# EAGLE design artik530_SOM (EAGLE 9.0.0)
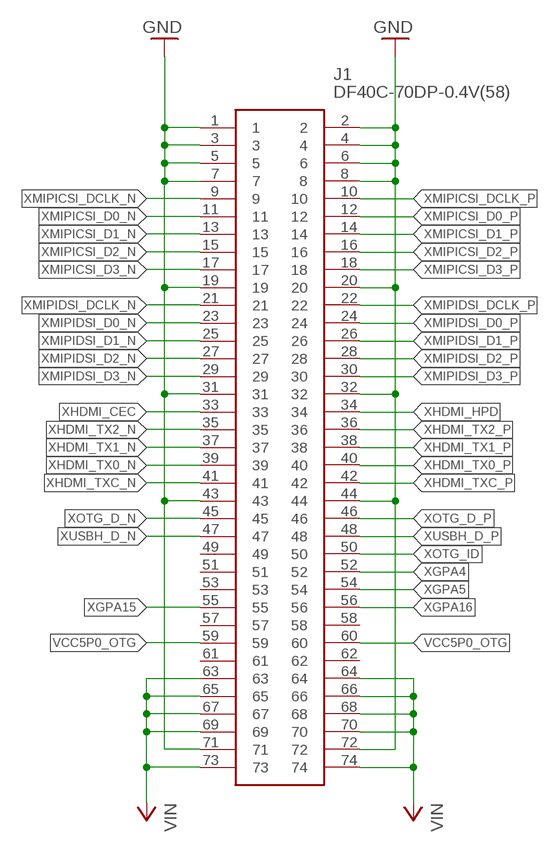
[diagram p0: schematic, sheet 1, part 1 of 2]
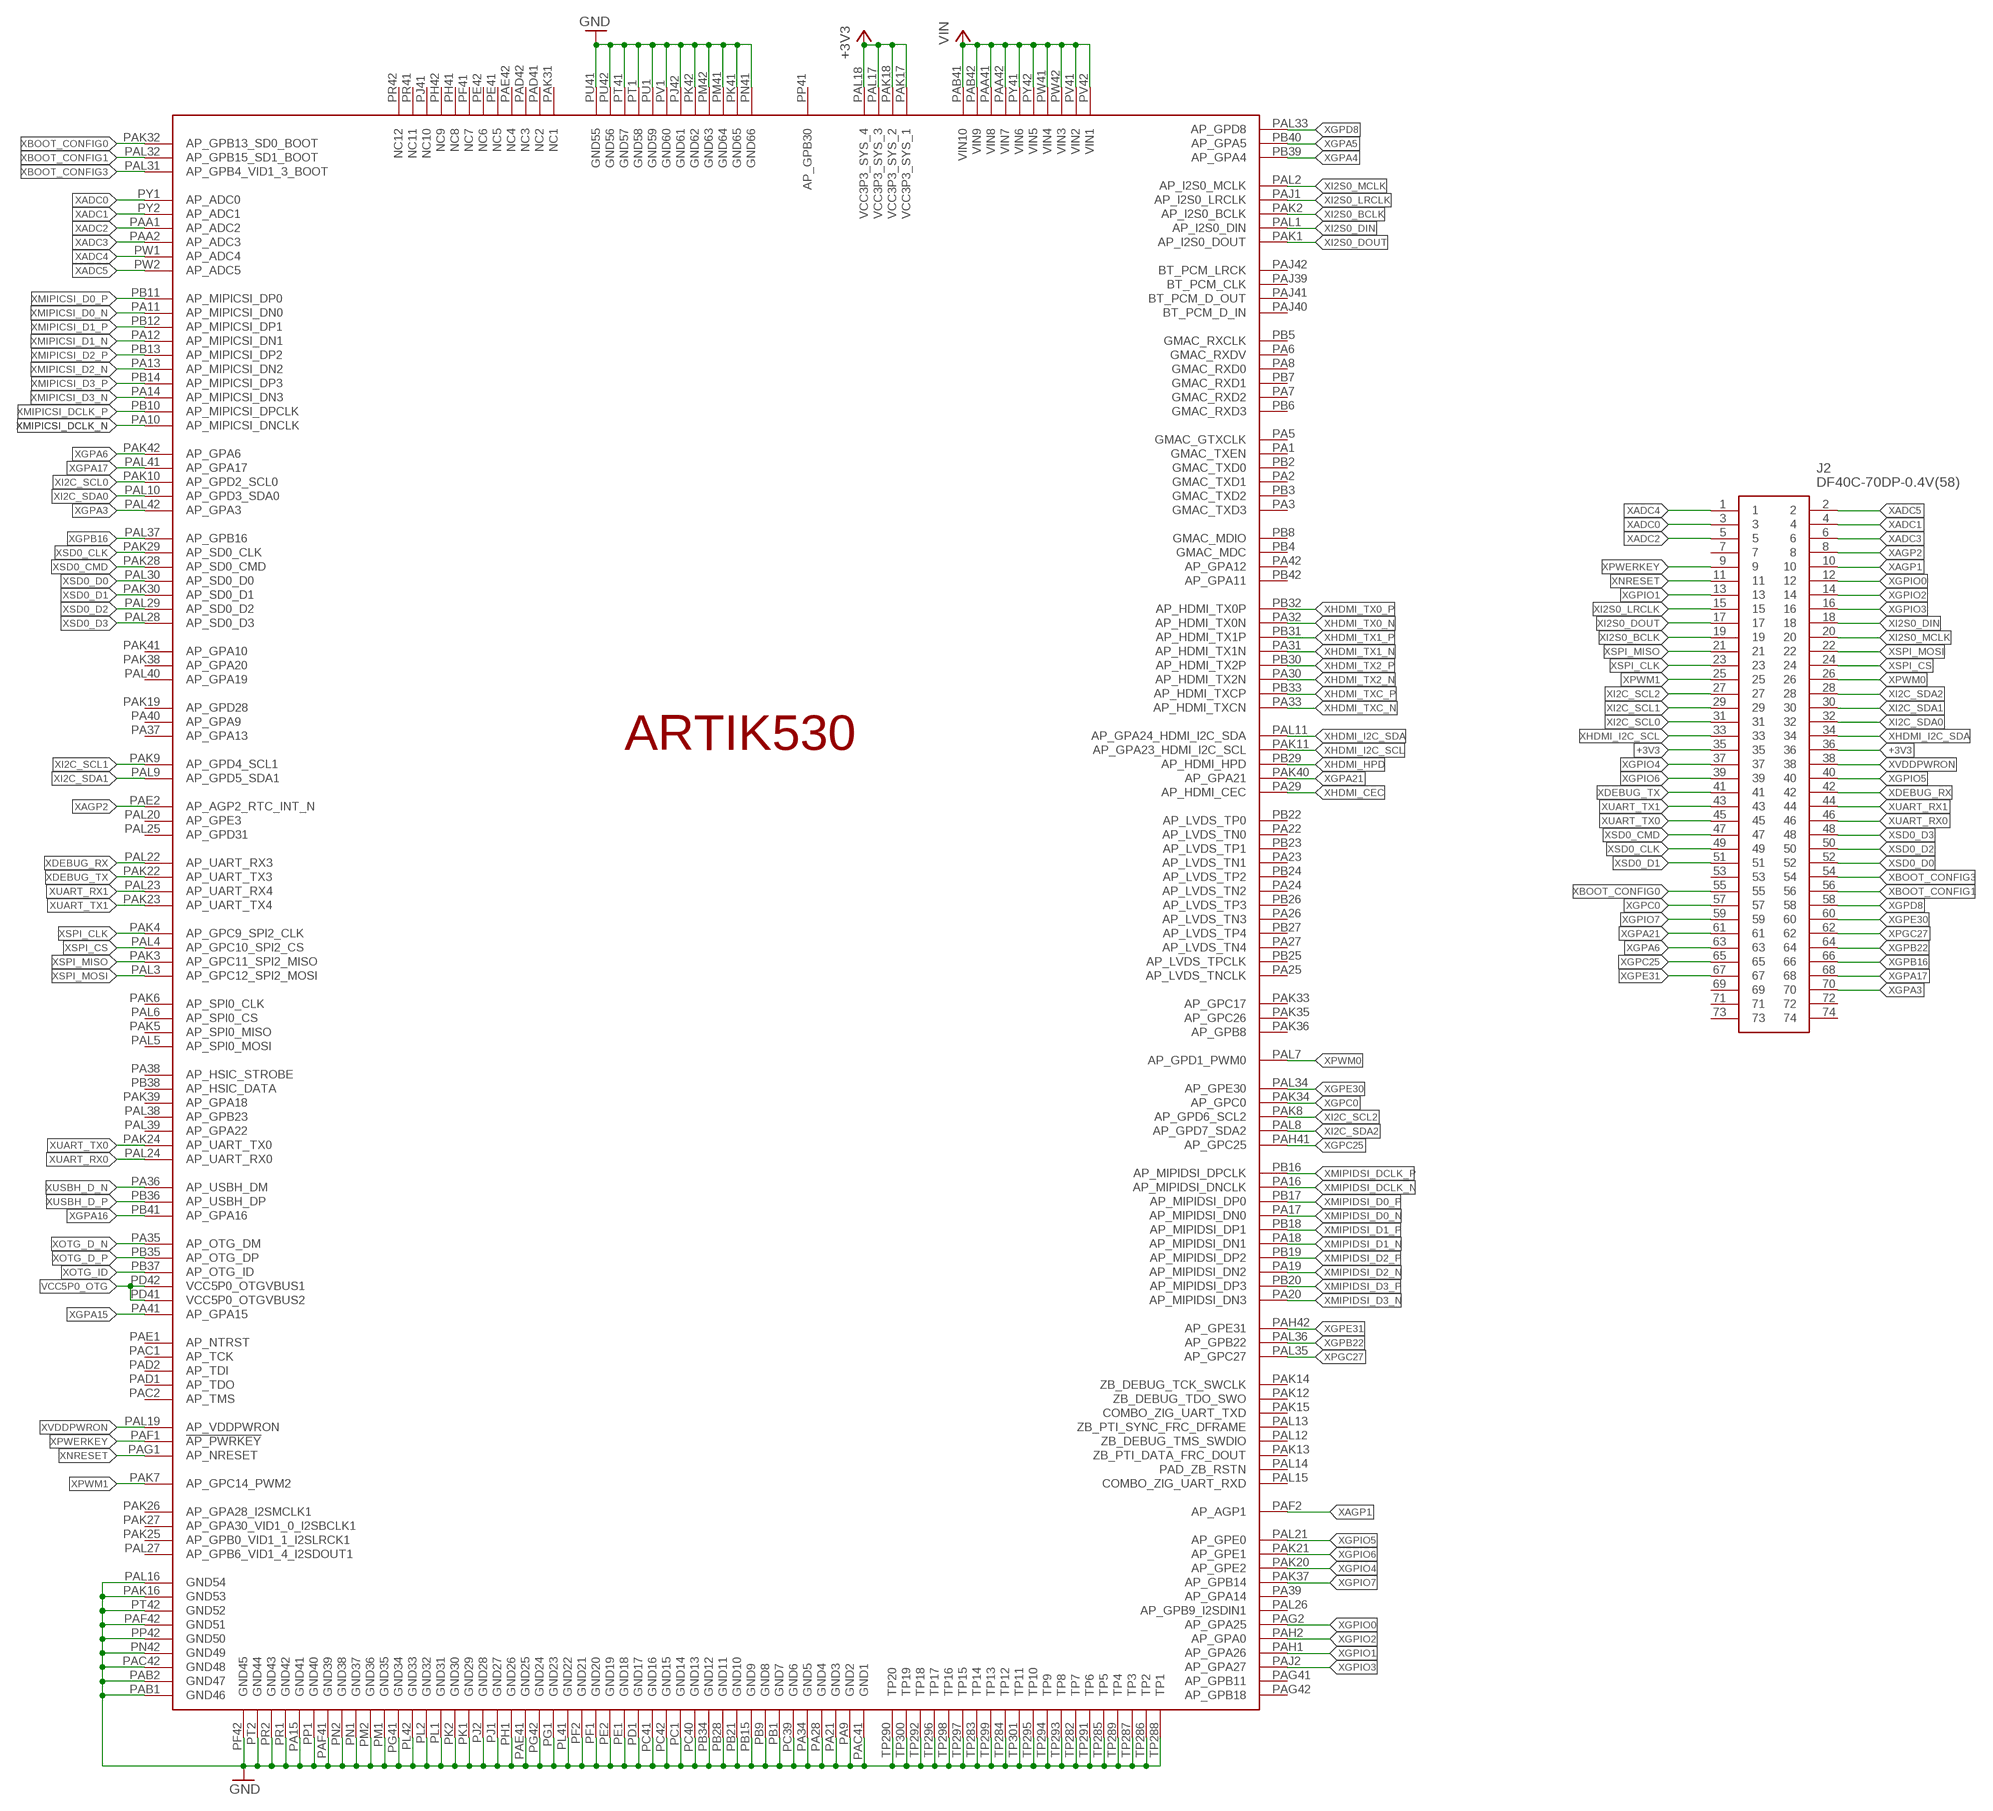
[diagram p1: schematic, sheet 1, part 2 of 2]

## Parts
J1  DF40C-70DP-0.4V(58)  [DF40C70DP04V58]
J2  DF40C-70DP-0.4V(58)  [DF40C70DP04V58]
U$1  ARTIK530ARTIK530_SOM  [ARTIK5]

## Nets
+3V3: J2.35 J2.36 U$1.PAK17(VCC3P3_SYS_1) U$1.PAK18(VCC3P3_SYS_2) U$1.PAL17(VCC3P3_SYS_3) U$1.PAL18(VCC3P3_SYS_4)
GND: J1.1 J1.2 J1.3 J1.4 J1.5 J1.6 J1.7 J1.8 J1.19 J1.20 J1.31 J1.32 J1.43 J1.44 J1.71 J1.72 U$1.PA9(GND2) U$1.PA15(GND41) U$1.PA21(GND3) U$1.PA28(GND4) U$1.PA34(GND5) U$1.PAB1(GND46) U$1.PAB2(GND47) U$1.PAC41(GND1) U$1.PAC42(GND48) U$1.PAE41(GND25) U$1.PAF41(GND39) U$1.PAF42(GND51) U$1.PAK16(GND53) U$1.PAL16(GND54) U$1.PB1(GND7) U$1.PB9(GND8) U$1.PB15(GND9) U$1.PB21(GND10) U$1.PB28(GND11) U$1.PB34(GND12) U$1.PC1(GND14) U$1.PC39(GND6) U$1.PC40(GND13) U$1.PC41(GND16) U$1.PC42(GND15) U$1.PD1(GND17) U$1.PE1(GND18) U$1.PE2(GND19) U$1.PF1(GND20) U$1.PF2(GND21) U$1.PF42(GND45) U$1.PG1(GND23) U$1.PG41(GND34) U$1.PG42(GND24) U$1.PH1(GND26) U$1.PJ1(GND27) U$1.PJ2(GND28) U$1.PJ42(GND61) U$1.PK1(GND29) U$1.PK2(GND30) U$1.PK41(GND65) U$1.PK42(GND62) U$1.PL1(GND31) U$1.PL2(GND32) U$1.PL41(GND22) U$1.PL42(GND33) U$1.PM1(GND35) U$1.PM2(GND36) U$1.PM41(GND64) U$1.PM42(GND63) U$1.PN1(GND37) U$1.PN2(GND38) U$1.PN41(GND66) U$1.PN42(GND49) U$1.PP1(GND40) U$1.PP42(GND50) U$1.PR1(GND42) U$1.PR2(GND43) U$1.PT1(GND58) U$1.PT2(GND44) U$1.PT41(GND57) U$1.PT42(GND52) U$1.PU1(GND59) U$1.PU41(GND55) U$1.PU42(GND56) U$1.PV1(GND60) U$1.TP282(TP7) U$1.TP283(TP14) U$1.TP284(TP12) U$1.TP285(TP5) U$1.TP286(TP2) U$1.TP287(TP3) U$1.TP288(TP1) U$1.TP289(TP4) U$1.TP290(TP20) U$1.TP291(TP6) U$1.TP292(TP18) U$1.TP293(TP8) U$1.TP294(TP9) U$1.TP295(TP10) U$1.TP296(TP17) U$1.TP297(TP15) U$1.TP298(TP16) U$1.TP299(TP13) U$1.TP300(TP19) U$1.TP301(TP11)
VCC: J1.63 J1.64 J1.65 J1.66 J1.67 J1.68 J1.69 J1.70 J1.73 J1.74 U$1.PAA41(VIN8) U$1.PAA42(VIN7) U$1.PAB41(VIN10) U$1.PAB42(VIN9) U$1.PV41(VIN2) U$1.PV42(VIN1) U$1.PW41(VIN4) U$1.PW42(VIN3) U$1.PY41(VIN6) U$1.PY42(VIN5) ; supply symbol labelled VIN
VCC5P0_OTG: J1.59 J1.60 U$1.PD41(VCC5P0_OTGVBUS2) U$1.PD42(VCC5P0_OTGVBUS1)
XADC0: J2.3 U$1.PY1(AP_ADC0)
XADC1: J2.4 U$1.PY2(AP_ADC1)
XADC2: J2.5 U$1.PAA1(AP_ADC2)
XADC3: J2.6 U$1.PAA2(AP_ADC3)
XADC4: J2.1 U$1.PW1(AP_ADC4)
XADC5: J2.2 U$1.PW2(AP_ADC5)
XAGP1: J2.10 U$1.PAF2(AP_AGP1)
XAGP2: J2.8 U$1.PAE2(AP_AGP2_RTC_INT_N)
XBOOT_CONFIG0: J2.55 U$1.PAK32(AP_GPB13_SD0_BOOT)
XBOOT_CONFIG1: J2.56 U$1.PAL32(AP_GPB15_SD1_BOOT)
XBOOT_CONFIG3: J2.54 U$1.PAL31(AP_GPB4_VID1_3_BOOT)
XDEBUG_RX: J2.42 U$1.PAL22(AP_UART_RX3)
XDEBUG_TX: J2.41 U$1.PAK22(AP_UART_TX3)
XGPA3: J2.70 U$1.PAL42(AP_GPA3)
XGPA4: J1.52 U$1.PB39(AP_GPA4)
XGPA5: J1.54 U$1.PB40(AP_GPA5)
XGPA6: J2.63 U$1.PAK42(AP_GPA6)
XGPA15: J1.55 U$1.PA41(AP_GPA15)
XGPA16: J1.56 U$1.PB41(AP_GPA16)
XGPA17: J2.68 U$1.PAL41(AP_GPA17)
XGPA21: J2.61 U$1.PAK40(AP_GPA21)
XGPB16: J2.66 U$1.PAL37(AP_GPB16)
XGPB22: J2.64 U$1.PAL36(AP_GPB22)
XGPC0: J2.57 U$1.PAK34(AP_GPC0)
XGPC25: J2.65 U$1.PAH41(AP_GPC25)
XGPD8: J2.58 U$1.PAL33(AP_GPD8)
XGPE30: J2.60 U$1.PAL34(AP_GPE30)
XGPE31: J2.67 U$1.PAH42(AP_GPE31)
XGPIO0: J2.12 U$1.PAG2(AP_GPA25)
XGPIO1: J2.13 U$1.PAH1(AP_GPA26)
XGPIO2: J2.14 U$1.PAH2(AP_GPA0)
XGPIO3: J2.16 U$1.PAJ2(AP_GPA27)
XGPIO4: J2.37 U$1.PAK20(AP_GPE2)
XGPIO5: J2.40 U$1.PAL21(AP_GPE0)
XGPIO6: J2.39 U$1.PAK21(AP_GPE1)
XGPIO7: J2.59 U$1.PAK37(AP_GPB14)
XHDMI_CEC: J1.33 U$1.PA29(AP_HDMI_CEC)
XHDMI_HPD: J1.34 U$1.PB29(AP_HDMI_HPD)
XHDMI_I2C_SCL: J2.33 U$1.PAK11(AP_GPA23_HDMI_I2C_SCL)
XHDMI_I2C_SDA: J2.34 U$1.PAL11(AP_GPA24_HDMI_I2C_SDA)
XHDMI_TX0_N [differential]: J1.39 U$1.PA32(AP_HDMI_TX0N)
XHDMI_TX0_P [differential]: J1.40 U$1.PB32(AP_HDMI_TX0P)
XHDMI_TX1_N [differential]: J1.37 U$1.PA31(AP_HDMI_TX1N)
XHDMI_TX1_P [differential]: J1.38 U$1.PB31(AP_HDMI_TX1P)
XHDMI_TX2_N [differential]: J1.35 U$1.PA30(AP_HDMI_TX2N)
XHDMI_TX2_P [differential]: J1.36 U$1.PB30(AP_HDMI_TX2P)
XHDMI_TXC_N [differential]: J1.41 U$1.PA33(AP_HDMI_TXCN)
XHDMI_TXC_P [differential]: J1.42 U$1.PB33(AP_HDMI_TXCP)
XI2C_SCL0: J2.31 U$1.PAK10(AP_GPD2_SCL0)
XI2C_SCL1: J2.29 U$1.PAK9(AP_GPD4_SCL1)
XI2C_SCL2: J2.27 U$1.PAK8(AP_GPD6_SCL2)
XI2C_SDA0: J2.32 U$1.PAL10(AP_GPD3_SDA0)
XI2C_SDA1: J2.30 U$1.PAL9(AP_GPD5_SDA1)
XI2C_SDA2: J2.28 U$1.PAL8(AP_GPD7_SDA2)
XI2S0_BCLK: J2.19 U$1.PAK2(AP_I2S0_BCLK)
XI2S0_DIN: J2.18 U$1.PAL1(AP_I2S0_DIN)
XI2S0_DOUT: J2.17 U$1.PAK1(AP_I2S0_DOUT)
XI2S0_LRCLK: J2.15 U$1.PAJ1(AP_I2S0_LRCLK)
XI2S0_MCLK: J2.20 U$1.PAL2(AP_I2S0_MCLK)
XMIPICSI_D0_N [differential]: J1.11 U$1.PA11(AP_MIPICSI_DN0)
XMIPICSI_D0_P [differential]: J1.12 U$1.PB11(AP_MIPICSI_DP0)
XMIPICSI_D1_N [differential]: J1.13 U$1.PA12(AP_MIPICSI_DN1)
XMIPICSI_D1_P [differential]: J1.14 U$1.PB12(AP_MIPICSI_DP1)
XMIPICSI_D2_N [differential]: J1.15 U$1.PA13(AP_MIPICSI_DN2)
XMIPICSI_D2_P [differential]: J1.16 U$1.PB13(AP_MIPICSI_DP2)
XMIPICSI_D3_N [differential]: J1.17 U$1.PA14(AP_MIPICSI_DN3)
XMIPICSI_D3_P [differential]: J1.18 U$1.PB14(AP_MIPICSI_DP3)
XMIPICSI_DCLK_N [differential]: J1.9 U$1.PA10(AP_MIPICSI_DNCLK)
XMIPICSI_DCLK_P [differential]: J1.10 U$1.PB10(AP_MIPICSI_DPCLK)
XMIPIDSI_D0_N [differential]: J1.23 U$1.PA17(AP_MIPIDSI_DN0)
XMIPIDSI_D0_P [differential]: J1.24 U$1.PB17(AP_MIPIDSI_DP0)
XMIPIDSI_D1_N [differential]: J1.25 U$1.PA18(AP_MIPIDSI_DN1)
XMIPIDSI_D1_P [differential]: J1.26 U$1.PB18(AP_MIPIDSI_DP1)
XMIPIDSI_D2_N [differential]: J1.27 U$1.PA19(AP_MIPIDSI_DN2)
XMIPIDSI_D2_P [differential]: J1.28 U$1.PB19(AP_MIPIDSI_DP2)
XMIPIDSI_D3_N [differential]: J1.29 U$1.PA20(AP_MIPIDSI_DN3)
XMIPIDSI_D3_P [differential]: J1.30 U$1.PB20(AP_MIPIDSI_DP3)
XMIPIDSI_DCLK_N [differential]: J1.21 U$1.PA16(AP_MIPIDSI_DNCLK)
XMIPIDSI_DCLK_P [differential]: J1.22 U$1.PB16(AP_MIPIDSI_DPCLK)
XNRESET: J2.11 U$1.PAG1(AP_NRESET)
XOTG_D_N [differential]: J1.45 U$1.PA35(AP_OTG_DM)
XOTG_D_P [differential]: J1.46 U$1.PB35(AP_OTG_DP)
XOTG_ID: J1.50 U$1.PB37(AP_OTG_ID)
XPGC27: J2.62 U$1.PAL35(AP_GPC27)
XPWERKEY: J2.9 U$1.PAF1(!AP_PWRKEY)
XPWM0: J2.26 U$1.PAL7(AP_GPD1_PWM0)
XPWM1: J2.25 U$1.PAK7(AP_GPC14_PWM2)
XSD0_CLK: J2.49 U$1.PAK29(AP_SD0_CLK)
XSD0_CMD: J2.47 U$1.PAK28(AP_SD0_CMD)
XSD0_D0: J2.52 U$1.PAL30(AP_SD0_D0)
XSD0_D1: J2.51 U$1.PAK30(AP_SD0_D1)
XSD0_D2: J2.50 U$1.PAL29(AP_SD0_D2)
XSD0_D3: J2.48 U$1.PAL28(AP_SD0_D3)
XSPI_CLK: J2.23 U$1.PAK4(AP_GPC9_SPI2_CLK)
XSPI_CS: J2.24 U$1.PAL4(AP_GPC10_SPI2_CS)
XSPI_MISO: J2.21 U$1.PAK3(AP_GPC11_SPI2_MISO)
XSPI_MOSI: J2.22 U$1.PAL3(AP_GPC12_SPI2_MOSI)
XUART_RX0: J2.46 U$1.PAL24(AP_UART_RX0)
XUART_RX1: J2.44 U$1.PAL23(AP_UART_RX4)
XUART_TX0: J2.45 U$1.PAK24(AP_UART_TX0)
XUART_TX1: J2.43 U$1.PAK23(AP_UART_TX4)
XUSBH_D_N [differential]: J1.47 U$1.PA36(AP_USBH_DM)
XUSBH_D_P [differential]: J1.48 U$1.PB36(AP_USBH_DP)
XVDDPWRON: J2.38 U$1.PAL19(AP_VDDPWRON)
Unconnected: J1.49 J1.51 J1.53 J1.57 J1.58 J1.61 J1.62 J2.7 J2.53 J2.69 J2.71 J2.72 J2.73 J2.74 U$1.PA1(GMAC_TXEN) U$1.PA2(GMAC_TXD1) U$1.PA3(GMAC_TXD3) U$1.PA5(GMAC_GTXCLK) U$1.PA6(GMAC_RXDV) U$1.PA7(GMAC_RXD2) U$1.PA8(GMAC_RXD0) U$1.PA22(AP_LVDS_TN0) U$1.PA23(AP_LVDS_TN1) U$1.PA24(AP_LVDS_TN2) U$1.PA25(AP_LVDS_TNCLK) U$1.PA26(AP_LVDS_TN3) U$1.PA27(AP_LVDS_TN4) U$1.PA37(AP_GPA13) U$1.PA38(AP_HSIC_STROBE) U$1.PA39(AP_GPA14) U$1.PA40(AP_GPA9) U$1.PA42(AP_GPA12) U$1.PAC1(AP_TCK) U$1.PAC2(AP_TMS) U$1.PAD1(AP_TDO) U$1.PAD2(AP_TDI) U$1.PAD41(NC2) U$1.PAD42(NC3) U$1.PAE1(AP_NTRST) U$1.PAE42(NC4) U$1.PAG41(AP_GPB11) U$1.PAG42(AP_GPB18) U$1.PAJ39(BT_PCM_CLK) U$1.PAJ40(BT_PCM_D_IN) U$1.PAJ41(BT_PCM_D_OUT) U$1.PAJ42(BT_PCM_LRCK) U$1.PAK5(AP_SPI0_MISO) U$1.PAK6(AP_SPI0_CLK) U$1.PAK12(ZB_DEBUG_TDO_SWO) U$1.PAK13(ZB_PTI_DATA_FRC_DOUT) U$1.PAK14(ZB_DEBUG_TCK_SWCLK) U$1.PAK15(COMBO_ZIG_UART_TXD) U$1.PAK19(AP_GPD28) U$1.PAK25(AP_GPB0_VID1_1_I2SLRCK1) U$1.PAK26(AP_GPA28_I2SMCLK1) U$1.PAK27(AP_GPA30_VID1_0_I2SBCLK1) U$1.PAK31(NC1) U$1.PAK33(AP_GPC17) U$1.PAK35(AP_GPC26) U$1.PAK36(AP_GPB8) U$1.PAK38(AP_GPA20) U$1.PAK39(AP_GPA18) U$1.PAK41(AP_GPA10) U$1.PAL5(AP_SPI0_MOSI) U$1.PAL6(AP_SPI0_CS) U$1.PAL12(ZB_DEBUG_TMS_SWDIO) U$1.PAL13(ZB_PTI_SYNC_FRC_DFRAME) U$1.PAL14(PAD_ZB_RSTN) U$1.PAL15(COMBO_ZIG_UART_RXD) U$1.PAL20(AP_GPE3) U$1.PAL25(AP_GPD31) U$1.PAL26(AP_GPB9_I2SDIN1) U$1.PAL27(AP_GPB6_VID1_4_I2SDOUT1) U$1.PAL38(AP_GPB23) U$1.PAL39(AP_GPA22) U$1.PAL40(AP_GPA19) U$1.PB2(GMAC_TXD0) U$1.PB3(GMAC_TXD2) U$1.PB4(GMAC_MDC) U$1.PB5(GMAC_RXCLK) U$1.PB6(GMAC_RXD3) U$1.PB7(GMAC_RXD1) U$1.PB8(GMAC_MDIO) U$1.PB22(AP_LVDS_TP0) U$1.PB23(AP_LVDS_TP1) U$1.PB24(AP_LVDS_TP2) U$1.PB25(AP_LVDS_TPCLK) U$1.PB26(AP_LVDS_TP3) U$1.PB27(AP_LVDS_TP4) U$1.PB38(AP_HSIC_DATA) U$1.PB42(AP_GPA11) U$1.PE41(NC5) U$1.PE42(NC6) U$1.PF41(NC7) U$1.PH41(NC8) U$1.PH42(NC9) U$1.PJ41(NC10) U$1.PP41(AP_GPB30) U$1.PR41(NC11) U$1.PR42(NC12)

## Library data of the parts
J1 J2 = DF40C-70DP-0.4V(51):DF40C-70DP-0.4V(58): Hirose DF40 Series, 0.4mm Pitch 70 Way 2 Row Straight PCB Header, Solder Termination, 0.3A Source: Datasheet <https://www.hirose.com/product/en/download_file/key_name/DF40C-70DP-0.4V(51)/category/Drawing (2D)/doc_file_id/145625/?file_category_id=6&item_id=06844015258&is_series=>; ARROW_PART_NUMBER: DF40C-70DP-0.4V(51); ARROW_PRICE/STOCK: http://uk.rs-online.com/web/p/products/1664877; DESCRIPTION: Hirose DF40 Series, 0.4mm Pitch 70 Way 2 Row Straight PCB Header, Solder Termination, 0.3A; HEIGHT: 1mm; MANUFACTURER_NAME: Hirose; MANUFACTURER_PART_NUMBER: DF40C-70DP-0.4V(51); RS_PART_NUMBER: 1664877; RS_PRICE/STOCK: http://uk.rs-online.com/web/p/products/1664877
U$1 = ARTIK530_EAGLE_LIB:ARTIK530

## Net classes
1 differential: width 0.127 mm, drill 0.3 mm, clearance 0.127 mm

## Board
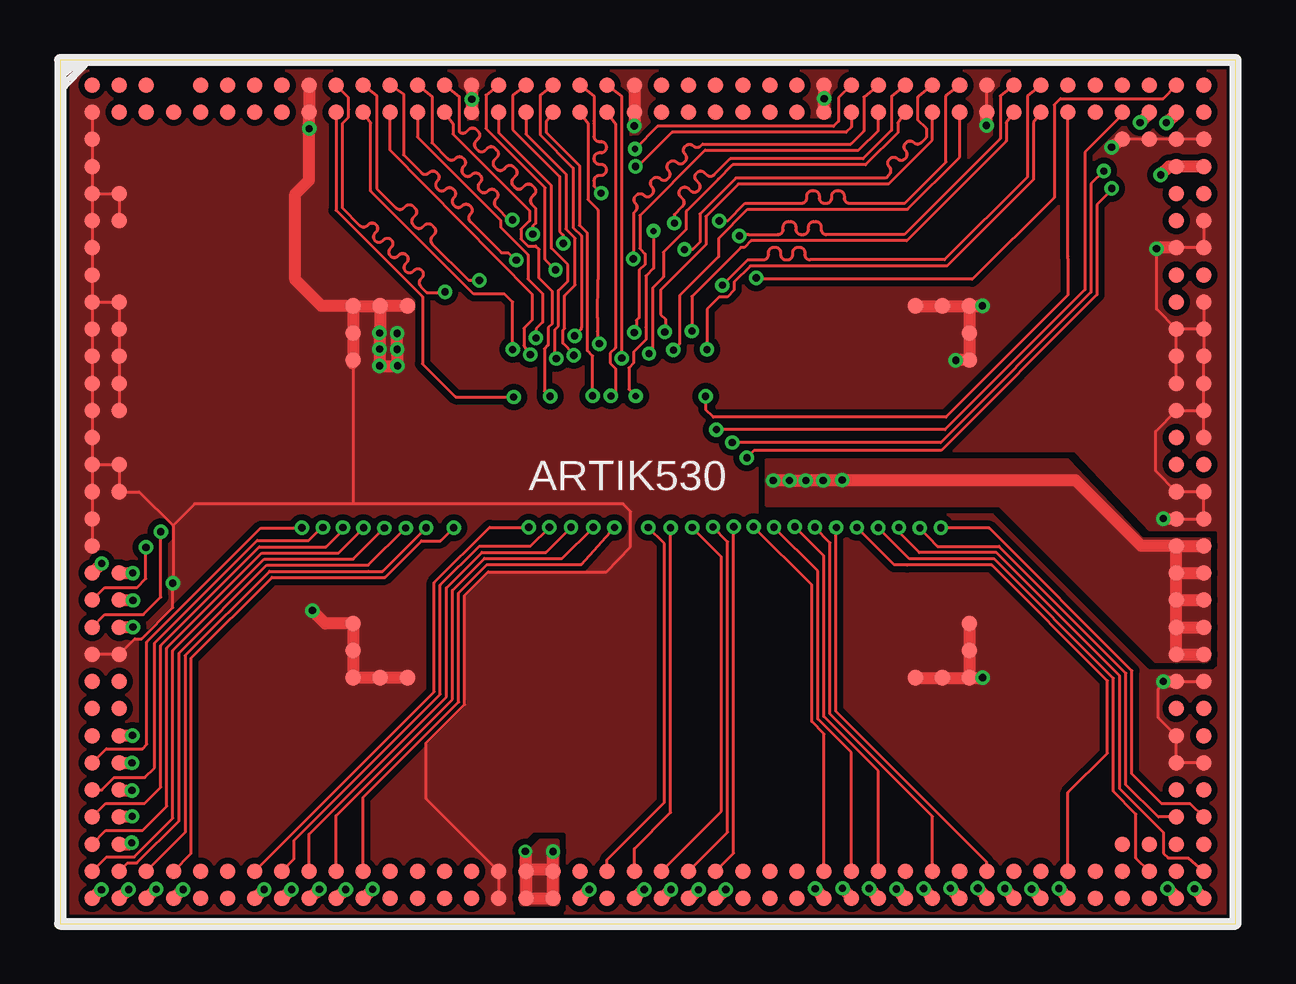
[diagram p2: board, top side]
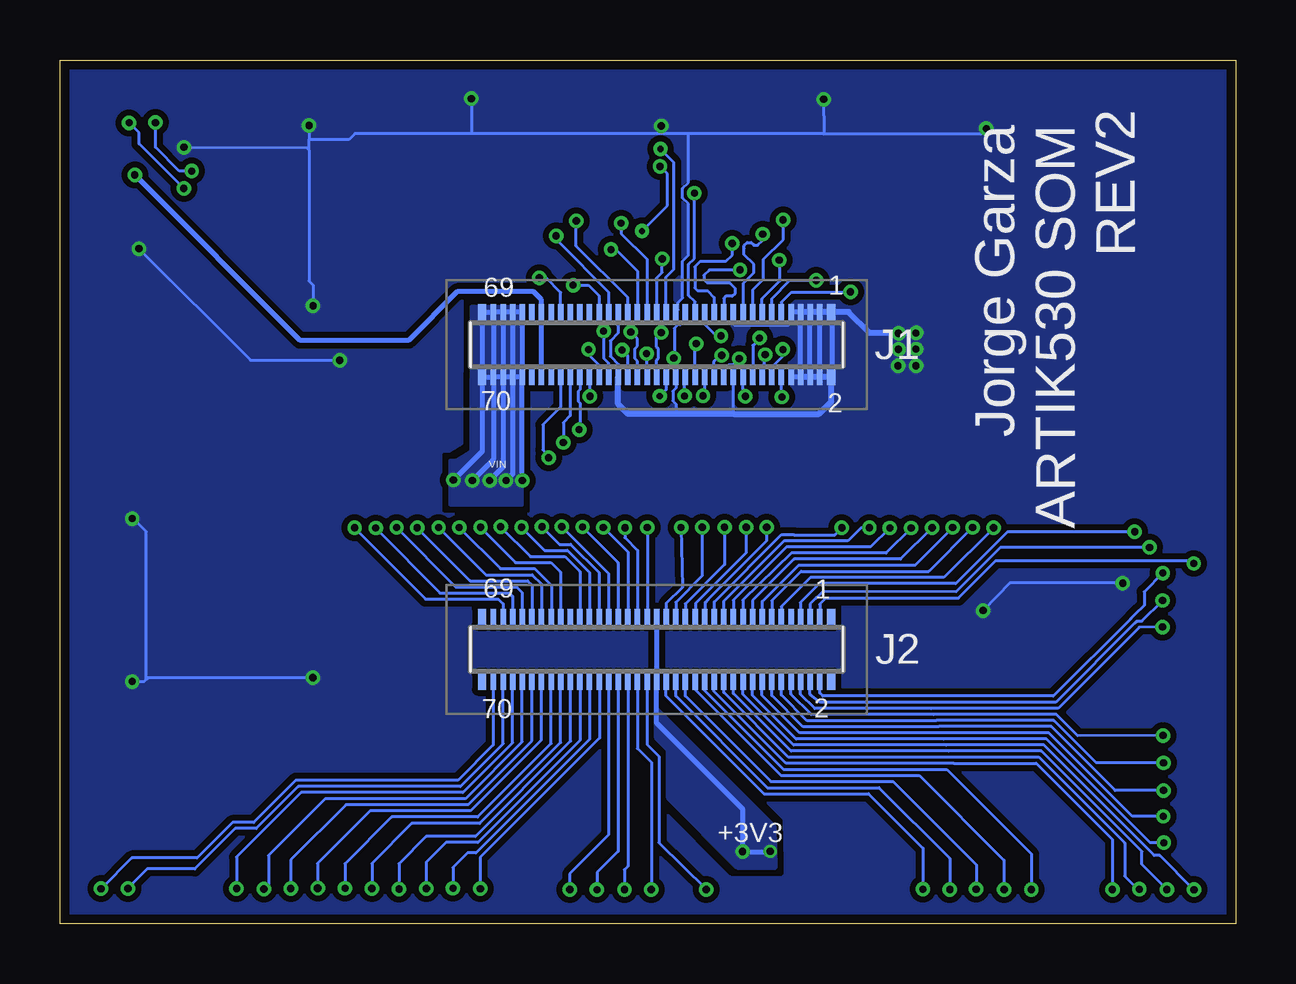
[diagram p3: board, bottom side, seen from below]

Size 49 x 36 mm. Coordinates in mm from the lower left corner, seen from the top.
Outline: 0,0 49,0 49,36 0,36 0,0
Copper layers (1*16): Top 0.035559375mm / dielectric 1.6mm / Bottom 0.035559375mm
Design rules "oshpark-2layer": minimum track width 5mil, minimum drill 10mil, track to track 5mil, track to pad 5mil, pad to pad 5mil, via to via 5mil, smd to smd 5mil, copper to edge 15mil, drill to drill 6mil, minimum pad ring 5mil, minimum via ring 5mil, stop-mask expansion 2.5mil, vias tented up to drill 15mil, thermal gap 10mil

### Footprints (pad centres in the part's own frame; a part is rotated, then mirrored left to right if it is on the bottom)
DF40C70DP04V58 = smd 0.23 x 0.66: 1 -6.8,-1.355; 2 -6.8,1.355; 3 -6.4,-1.355; 4 -6.4,1.355; 5 -6,-1.355; 6 -6,1.355; 7 -5.6,-1.355; 8 -5.6,1.355; 9 -5.2,-1.355; 10 -5.2,1.355; 11 -4.8,-1.355; 12 -4.8,1.355; 13 -4.4,-1.355; 14 -4.4,1.355; 15 -4,-1.355; 16 -4,1.355; 17 -3.6,-1.355; 18 -3.6,1.355; 19 -3.2,-1.355; 20 -3.2,1.355; 21 -2.8,-1.355; 22 -2.8,1.355; 23 -2.4,-1.355; 24 -2.4,1.355; 25 -2,-1.355; 26 -2,1.355; 27 -1.6,-1.355; 28 -1.6,1.355; 29 -1.2,-1.355; 30 -1.2,1.355; 31 -0.8,-1.355; 32 -0.8,1.355; 33 -0.4,-1.355; 34 -0.4,1.355; 35 0,-1.355; 36 0,1.355; 37 0.4,-1.355; 38 0.4,1.355; 39 0.8,-1.355; 40 0.8,1.355; 41 1.2,-1.355; 42 1.2,1.355; 43 1.6,-1.355; 44 1.6,1.355; 45 2,-1.355; 46 2,1.355; 47 2.4,-1.355; 48 2.4,1.355; 49 2.8,-1.355; 50 2.8,1.355; 51 3.2,-1.355; 52 3.2,1.355; 53 3.6,-1.355; 54 3.6,1.355; 55 4,-1.355; 56 4,1.355; 57 4.4,-1.355; 58 4.4,1.355; 59 4.8,-1.355; 60 4.8,1.355; 61 5.2,-1.355; 62 5.2,1.355; 63 5.6,-1.355; 64 5.6,1.355; 65 6,-1.355; 66 6,1.355; 67 6.4,-1.355; 68 6.4,1.355; 69 6.8,-1.355; 70 6.8,1.355 | smd 0.35 x 0.66: 71 -7.275,-1.355; 72 -7.275,1.355; 73 7.275,1.355; 74 7.275,-1.355
ARTIK5 = smd 0.65 x 0.65: PA1 1.34,34.95; PA2 2.47,34.95; PA3 3.6,34.95; PA5 5.86,34.95; PA6 6.99,34.95; PA7 8.12,34.95; PA8 9.25,34.95; PA9 10.38,34.95; PA10 11.51,34.95; PA11 12.64,34.95; PA12 13.77,34.95; PA13 14.9,34.95; PA14 16.03,34.95; PA15 17.16,34.95; PA16 18.29,34.95; PA17 19.42,34.95; PA18 20.55,34.95; PA19 21.68,34.95; PA20 22.81,34.95; PA21 23.94,34.95; PA22 25.07,34.95; PA23 26.2,34.95; PA24 27.33,34.95; PA25 28.46,34.95; PA26 29.59,34.95; PA27 30.72,34.95; PA28 31.85,34.95; PA29 32.98,34.95; PA30 34.11,34.95; PA31 35.24,34.95; PA32 36.37,34.95; PA33 37.5,34.95; PA34 38.63,34.95; PA35 39.76,34.95; PA36 40.89,34.95; PA37 42.02,34.95; PA38 43.15,34.95; PA39 44.28,34.95; PA40 45.41,34.95; PA41 46.54,34.95; PA42 47.67,34.95; PAA1 1.34,12.35; PAA2 2.47,12.35; PAA41 46.54,12.35; PAA42 47.67,12.35; PAB1 1.34,11.22; PAB2 2.47,11.22; PAB41 46.54,11.22; PAB42 47.67,11.22; PAC1 1.34,10.09; PAC2 2.47,10.09; PAC41 46.54,10.09; PAC42 47.67,10.09; PAD1 1.34,8.96; PAD2 2.47,8.96; PAD41 46.54,8.96; PAD42 47.67,8.96; PAE1 1.34,7.83; PAE2 2.47,7.83; PAE41 46.54,7.83; PAE42 47.67,7.83; PAF1 1.34,6.7; PAF2 2.47,6.7; PAF41 46.54,6.7; PAF42 47.67,6.7; PAG1 1.34,5.57; PAG2 2.47,5.57; PAG41 46.54,5.57; PAG42 47.67,5.57; PAH1 1.34,4.44; PAH2 2.47,4.44; PAH41 46.54,4.44; PAH42 47.67,4.44; PAJ1 1.34,3.31; PAJ2 2.47,3.31; PAJ39 44.28,3.31; PAJ40 45.41,3.31; PAJ41 46.54,3.31; PAJ42 47.67,3.31; PAK1 1.34,2.18; PAK2 2.47,2.18; PAK3 3.6,2.18; PAK4 4.73,2.18; PAK5 5.86,2.18; PAK6 6.99,2.18; PAK7 8.12,2.18; PAK8 9.25,2.18; PAK9 10.38,2.18; PAK10 11.51,2.18; PAK11 12.64,2.18; PAK12 13.77,2.18; PAK13 14.9,2.18; PAK14 16.03,2.18; PAK15 17.16,2.18; PAK16 18.29,2.18; PAK17 19.42,2.18; PAK18 20.55,2.18; PAK19 21.68,2.18; PAK20 22.81,2.18; PAK21 23.94,2.18; PAK22 25.07,2.18; PAK23 26.2,2.18; PAK24 27.33,2.18; PAK25 28.46,2.18; PAK26 29.59,2.18; PAK27 30.72,2.18; PAK28 31.85,2.18; PAK29 32.98,2.18; PAK30 34.11,2.18; PAK31 35.24,2.18; PAK32 36.37,2.18; PAK33 37.5,2.18; PAK34 38.63,2.18; PAK35 39.76,2.18; PAK36 40.89,2.18; PAK37 42.02,2.18; PAK38 43.15,2.18; PAK39 44.28,2.18; PAK40 45.41,2.18; PAK41 46.54,2.18; PAK42 47.67,2.18; PAL1 1.34,1.05; PAL2 2.47,1.05; PAL3 3.6,1.05; PAL4 4.73,1.05; PAL5 5.86,1.05; PAL6 6.99,1.05; PAL7 8.12,1.05; PAL8 9.25,1.05; PAL9 10.38,1.05; PAL10 11.51,1.05; PAL11 12.64,1.05; PAL12 13.77,1.05; PAL13 14.9,1.05; PAL14 16.03,1.05; PAL15 17.16,1.05; PAL16 18.29,1.05; PAL17 19.42,1.05; PAL18 20.55,1.05; PAL19 21.68,1.05; PAL20 22.81,1.05; PAL21 23.94,1.05; PAL22 25.07,1.05; PAL23 26.2,1.05; PAL24 27.33,1.05; PAL25 28.46,1.05; PAL26 29.59,1.05; PAL27 30.72,1.05; PAL28 31.85,1.05; PAL29 32.98,1.05; PAL30 34.11,1.05; PAL31 35.24,1.05; PAL32 36.37,1.05; PAL33 37.5,1.05; PAL34 38.63,1.05; PAL35 39.76,1.05; PAL36 40.89,1.05; PAL37 42.02,1.05; PAL38 43.15,1.05; PAL39 44.28,1.05; PAL40 45.41,1.05; PAL41 46.54,1.05; PAL42 47.67,1.05; PB1 1.34,33.82; PB2 2.47,33.82; PB3 3.6,33.82; PB4 4.73,33.82; PB5 5.86,33.82; PB6 6.99,33.82; PB7 8.12,33.82; PB8 9.25,33.82; PB9 10.38,33.82; PB10 11.51,33.82; PB11 12.64,33.82; PB12 13.77,33.82; PB13 14.9,33.82; PB14 16.03,33.82; PB15 17.16,33.82; PB16 18.29,33.82; PB17 19.42,33.82; PB18 20.55,33.82; PB19 21.68,33.82; PB20 22.81,33.82; PB21 23.94,33.82; PB22 25.07,33.82; PB23 26.2,33.82; PB24 27.33,33.82; PB25 28.46,33.82; PB26 29.59,33.82; PB27 30.72,33.82; PB28 31.85,33.82; PB29 32.98,33.82; PB30 34.11,33.82; PB31 35.24,33.82; PB32 36.37,33.82; PB33 37.5,33.82; PB34 38.63,33.82; PB35 39.76,33.82; PB36 40.89,33.82; PB37 42.02,33.82; PB38 43.15,33.82; PB39 44.28,33.82; PB40 45.41,33.82; PB41 46.54,33.82; PB42 47.67,33.82; PC1 1.34,32.69; PC39 44.28,32.69; PC40 45.41,32.69; PC41 46.54,32.69; PC42 47.67,32.69; PD1 1.34,31.56; PD41 46.54,31.56; PD42 47.67,31.56; PE1 1.34,30.43; PE2 2.47,30.43; PE41 46.54,30.43; PE42 47.67,30.43; PF1 1.34,29.3; PF2 2.47,29.3; PF41 46.54,29.3; PF42 47.67,29.3; PG1 1.34,28.17; PG41 46.54,28.17; PG42 47.67,28.17; PH1 1.34,27.04; PH41 46.54,27.04; PH42 47.67,27.04; PJ1 1.34,25.91; PJ2 2.47,25.91; PJ41 46.54,25.91; PJ42 47.67,25.91; PK1 1.34,24.78; PK2 2.47,24.78; PK41 46.54,24.78; PK42 47.67,24.78; PL1 1.34,23.65; PL2 2.47,23.65; PL41 46.54,23.65; PL42 47.67,23.65; PM1 1.34,22.52; PM2 2.47,22.52; PM41 46.54,22.52; PM42 47.67,22.52; PN1 1.34,21.39; PN2 2.47,21.39; PN41 46.54,21.39; PN42 47.67,21.39; PP1 1.34,20.26; PP41 46.54,20.26; PP42 47.67,20.26; PR1 1.34,19.13; PR2 2.47,19.13; PR41 46.54,19.13; PR42 47.67,19.13; PT1 1.34,18; PT2 2.47,18; PT41 46.54,18; PT42 47.67,18; PU1 1.34,16.87; PU41 46.54,16.87; PU42 47.67,16.87; PV1 1.34,15.74; PV41 46.54,15.74; PV42 47.67,15.74; PW1 1.34,14.61; PW2 2.47,14.61; PW41 46.54,14.61; PW42 47.67,14.61; PY1 1.34,13.48; PY2 2.47,13.48; PY41 46.54,13.48; PY42 47.67,13.48; TP282 12.22,25.75; TP283 13.35,25.75; TP284 14.48,25.75; TP285 35.65,25.75; TP286 36.78,25.75; TP287 37.91,25.75; TP288 37.91,24.62; TP289 37.91,23.49; TP290 37.91,12.51; TP291 37.91,11.38; TP292 37.91,10.25; TP293 36.78,10.25; TP294 35.65,10.25; TP295 14.48,10.25; TP296 13.35,10.25; TP297 12.22,10.25; TP298 12.22,11.38; TP299 12.22,12.51; TP300 12.22,23.49; TP301 12.22,24.62

### Placement (x,y rotation side)
J1  24.13,24.13 180 bottom
J2  24.13,11.43 180 bottom
U$1  0,0 0 top

### Tracks (layer width: path | path; a pad name or v marks a point on that pad's centre or on a via)
+3V3  (via drill 0.3, 0.3 pad 0.6)
  Top 0.203: 19.42,2.99 v19.4,3.01
  Top 0.508: 19.42,2.23 U$1.PAK17 U$1.PAL17 U$1.PAL18 U$1.PAK18 | 19.42,2.23 19.42,2.99 | U$1.PAK18 v20.55,3 | U$1.PAK18 20.5,2.23 19.42,2.23
  Bottom 0.127: J2.36
  Bottom 0.203: J2.36 24.14,8.37 20.55,4.78 v20.55,3 v19.41,3 v19.4,3.01 | J2.35 J2.36
  pour Top (no thermals): 19.23,0.83 20.73,0.83 20.73,3.43 20.03,3.43 19.23,2.63
  pour Bottom (no thermals): 19.2,2.33 20.73,2.33 23.63,5.23 23.63,7.23 24.13,7.73 24.13,8.93 19.23,4.03
GND  (via drill 0.3 pad 0.6)
  Top 0.127: U$1.PB1 U$1.PC1 U$1.PD1 U$1.PE1 | U$1.PE1 U$1.PE2 U$1.PF2 | U$1.PE1 U$1.PF1 U$1.PG1 U$1.PH1 U$1.PJ1 | U$1.PJ1 U$1.PJ2 U$1.PK2 U$1.PL2 U$1.PM2 U$1.PN2 | U$1.PJ1 U$1.PK1 U$1.PL1 U$1.PM1 U$1.PN1 U$1.PP1 U$1.PR1 | U$1.PR1 U$1.PR2 U$1.PT2 3.3,18 4.71,16.59 | U$1.PR1 U$1.PT1 U$1.PU1 U$1.PV1 | U$1.PAF42 U$1.PAF41 U$1.PAE41 45.79,8.58 45.79,9.78 46.1,10.09 v45.99,10.09 | U$1.PN42 U$1.PN41 45.67,20.52 45.67,18.87 U$1.PT41 U$1.PT42 U$1.PU42 U$1.PU41 | U$1.PP42 U$1.PN42 | U$1.PN42 U$1.PM42 U$1.PL42 U$1.PK42 | U$1.PM41 U$1.PL41 U$1.PK41 | U$1.PJ42 U$1.PK42 | U$1.PK42 U$1.PK41 | U$1.PK41 45.71,25.61 v45.71,28.13 45.75,28.17 | U$1.PC42 U$1.PC41 U$1.PC40 U$1.PC39 | v10.39,33.14 10.38,33.86 U$1.PB9 | U$1.PAB1 U$1.PAB2 3.12,11.87 3.4,11.87 4.7,13.17 4.7,14.1 | 4.7,14.1 v4.7,14.19 | 4.71,16.59 4.71,14.11 4.7,14.1 | 4.71,16.59 5.61,17.49 12.18,17.49 | 12.18,17.49 23.47,17.49 23.79,17.17 23.78,15.7 22.78,14.66 17.85,14.66 16.87,13.68 16.87,9.13 15.27,7.53 15.27,5.2 U$1.PAK16 U$1.PAL16 | U$1.PF42 U$1.PG42 U$1.PG41 | 12.2,23.36 U$1.TP300 12.22,17.53 12.18,17.49 | 38.61,33.8 U$1.PB34 U$1.PA34 | U$1.PAC41 U$1.PAC42
  Top 0.508: U$1.PA9 10.38,33.86 10.38,30.98 9.81,30.41 9.81,26.84 10.9,25.75 U$1.TP282 | U$1.PA15 v17.17,34.36 U$1.PB15 | U$1.PA28 v31.85,34.39 U$1.PB28 | v38.62,33.27 38.61,33.8 | U$1.PA21 U$1.PB21 v23.94,33.25 | U$1.PG41 45.75,28.17 | v45.99,16.88 U$1.PU41 | 46.1,10.09 U$1.PAC41 | U$1.PC39 v43.83,32.36 | U$1.TP282 U$1.TP301 12.22,23.39 12.2,23.36 | U$1.TP282 U$1.TP283 | U$1.TP285 U$1.TP286 U$1.TP287 | U$1.TP287 U$1.TP288 U$1.TP289 v37.34,23.48 | U$1.TP287 v38.45,25.75 | U$1.TP283 13.35,24.65 v13.32,24.62 v13.32,23.95 v13.32,23.25 v14.07,23.25 14.07,23.92 v14.05,23.94 v14.05,24.6 | U$1.TP290 U$1.TP291 U$1.TP292 | U$1.TP294 U$1.TP293 U$1.TP292 | U$1.TP292 v38.46,10.25 | U$1.TP295 U$1.TP296 U$1.TP297 U$1.TP298 U$1.TP299 11.06,12.51 v10.52,13.05 | U$1.TP284 U$1.TP283
  Bottom 0.127: v45.99,10.09 45.49,10.09 45.4,10.18 | v4.7,14.19 9.27,14.2 9.4,14.2 v10.52,13.05 | 16.83,25.46 J1.71 | J1.72 16.83,22.8 | J1.1 17.31,25.48 17.33,25.46 | J1.3 17.78,25.48 17.73,25.43 | J1.5 18.11,25.48 18.13,25.46 | J1.20 20.93,21.26 20.92,21.25 | v17.17,34.36 17.16,32.96 17.19,32.93 | 17.19,32.93 22.86,32.93 | 22.86,32.93 23.97,32.93 | 23.97,32.93 31.81,32.93 | 31.81,32.93 36.7,32.93 36.95,32.68 38.6,32.68 38.61,32.69 | v31.85,34.39 31.85,32.97 31.81,32.93 | v23.94,33.25 23.94,32.96 23.97,32.93 | 23.36,21.25 23.33,21.28 23.33,21.67 23.45,21.79 23.45,22.2 23.33,22.32 J1.32 | J1.43 25.73,24.62 26.06,24.29 26.06,23.65 25.72,23.31 25.72,22.79 J1.44 | J1.31 23.23,25.58 23.23,25.89 23.05,26.08 23.05,27.62 22.81,27.86 22.81,30.01 23.05,30.25 23.05,30.65 22.81,30.89 22.81,32.88 22.86,32.93 | J1.19 20.93,24.99 20.88,24.94 18.64,24.94 18.53,25.05 J1.7 | v38.46,10.25 45.33,10.25 45.4,10.18 | v10.39,33.14 10.6,32.93 17.19,32.93 | v38.62,33.27 38.61,32.69 | 38.62,32.25 38.62,26.79 38.45,26.62 v38.45,25.75 | 38.62,32.25 38.62,32.68 38.61,32.69 | 45.4,10.18 45.4,16.34 45.94,16.88 v45.99,16.88 | v43.83,32.36 38.71,32.34 38.62,32.25 | v37.34,23.48 41.06,23.48 v45.71,28.13
  Bottom 0.203: 16.83,25.46 16.83,22.8 | J1.5 J1.7 | J1.2 17.33,25.46 | J1.4 17.73,25.43 | 18.13,25.46 J1.6 J1.8
  Bottom 0.254: J1.72 J1.2 J1.4 J1.6 | 17.31,25.48 J1.71 16.84,25.5 16.13,25.5 15.25,24.62 v13.32,24.62 | J1.1 J1.3 | 17.78,25.48 18.11,25.48 | J1.44 25.73,21.65 25.33,21.25 23.36,21.25 20.92,21.25 17.36,21.25 16.85,21.76 J1.72
  pour Bottom (isolate 0.25, rank 2, no thermals): -0.17,36.13 -0.17,-0.17 49.13,-0.17 49.13,36.13
  pour Top (isolate 0.25, rank 2, no thermals): -0.17,36.13 -0.17,-0.17 49.13,-0.17 49.13,36.13
VCC  (via drill 0.3 pad 0.6)
  Top 0.127: U$1.PAA41 46.57,12.35 46.54,12.32 | 29.8,18.47 29.72,18.39 v29.73,18.47
  Top 0.508: U$1.PAB42 U$1.PAB41 46.54,12.32 | 46.57,12.35 U$1.PAA42 | U$1.PAA41 U$1.PY41 | U$1.PY41 U$1.PW41 | U$1.PW41 U$1.PV41 | U$1.PV41 U$1.PV42 | U$1.PW41 U$1.PW42 | U$1.PY41 U$1.PY42 | U$1.PV41 45.07,15.74 42.34,18.47 v31.81,18.47 v31.09,18.47 v30.41,18.47 29.8,18.47
  Bottom 0.127: J1.64 29.73,22.67 29.73,22.7 | J1.67 30.52,25.48
  Bottom 0.203: v29.73,18.47 29.73,22.67 | J1.66 30.13,18.75 v30.41,18.47 | J1.68 30.53,19.03 v31.09,18.47 | J1.70 30.93,19.35 v31.81,18.47 | 29.73,22.7 J1.63 J1.65 | J1.65 J1.66 | J1.67 J1.68 | J1.69 J1.70 | J1.64 J1.66 | J1.66 J1.68 | J1.68 J1.70 | J1.65 30.52,25.48 | J1.67 J1.69 | J1.69 J1.74 J1.73 | J1.73 J1.70 | J1.73 31.41,19.68 v32.6,18.49
  pour Bottom (no thermals): 29.73,25.73 29.73,17.43 32.73,17.43 32.73,19.33 32.46,19.33 31.87,19.7 31.84,25.76
  pour Top (no thermals): 29.43,19.33 29.43,17.43 39.13,17.43 45.63,10.93 47.83,10.93 47.93,11.03 47.93,16.03 45.13,16.03 42.03,19.33
VCC5P0_OTG  (via drill 0.3 pad 0.6)
  Top 0.508: U$1.PD42 U$1.PD41 46.23,31.56 v45.88,31.21
  Bottom 0.203: J1.60 J1.59 28.93,26.01 29.26,26.34 32.44,26.34 34.47,24.31 37.86,24.31 38.98,24.31 v45.88,31.21
XADC0  (via drill 0.3 pad 0.6)
  Top 0.127: U$1.PY1 1.87,14.01 3.21,14.01 3.58,14.38 v3.58,15.68
  Bottom 0.127: v3.58,15.68 9.81,15.67 11.65,13.82 17.2,13.84 17.45,13.59 17.48,13.57 17.73,13.32 J2.3
XADC1  (via drill 0.3 pad 0.6)
  Top 0.127: 2.94,13.48 v3.04,13.47
  Top 0.508: U$1.PY2 2.94,13.48
  Bottom 0.127: J2.4 17.73,9.98 17.73,9.56 17.3,9.22 12.8,9.22 12.79,9.23 7.5,9.23 4.19,12.53 4.12,12.6 4.11,12.61 3.9,12.61 v3.04,13.47
XADC2  (via drill 0.3 pad 0.6)
  Top 0.127: U$1.PAA1 1.87,12.88 3.47,12.88 4.2,13.61 v4.2,16.33
  Bottom 0.127: v4.2,16.33 9.51,16.33 11.66,14.17 17.35,14.17 18.14,13.38 J2.5
XADC3  (via drill 0.3 pad 0.6)
  Top 0.127: U$1.PAA2
  Top 0.508: U$1.PAA2 v3.04,12.36
  Bottom 0.127: v3.04,12.36 4.01,12.35 7.39,8.97 12.69,8.97 12.7,8.97 17.54,8.97 18.13,9.56 J2.6
XADC4  (via drill 0.3 pad 0.6)
  Top 0.508: U$1.PW1 v1.74,15.01
  Bottom 0.127: J2.1 17.33,13.3 17.34,13.31 17.08,13.57 11.55,13.57 9.99,15.13 1.86,15.13 v1.74,15.01
XADC5  (via drill 0.3 pad 0.6)
  Top 0.127: 2.93,14.61 v3.03,14.61
  Top 0.508: U$1.PW2 2.93,14.61
  Bottom 0.127: J2.2 17.33,9.61 17.2,9.48 7.6,9.48 4.37,12.71 4.23,12.86 4.22,12.86 3.81,13.27 3.81,13.83 v3.03,14.61
XAGP1  (via drill 0.3 pad 0.6)
  Top 0.508: U$1.PAF2 v3,6.7
  Bottom 0.127: v3,6.7 5.81,6.7 7.57,8.46 12.48,8.46 17.86,8.46 18.93,9.53 J2.10
XAGP2  (via drill 0.3 pad 0.6)
  Top 0.508: U$1.PAE2 v3.02,7.84
  Bottom 0.127: v3.02,7.84 6.58,7.83 7.47,8.72 12.58,8.72 12.59,8.71 17.68,8.71 18.53,9.56 J2.8
XBOOT_CONFIG0  (via drill 0.3 pad 0.6)
  Top 0.127: U$1.PAK32 36.37,4.46 32.1,8.73 32.1,15.87 v31.47,16.52
  Bottom 0.127: v31.47,16.52 30.02,15.05 28.54,15.05 28.14,14.65 J2.55
XBOOT_CONFIG1  (via drill 0.3 pad 0.6)
  Top 0.508: U$1.PAL32 v36,1.46
  Bottom 0.127: J2.56 28.13,7.55 31.51,4.17 34.34,4.17 36,2.51 v36,1.46
XBOOT_CONFIG3  (via drill 0.3 pad 0.6)
  Top 0.127: U$1.PAL31
  Top 0.508: U$1.PAL31 v34.87,1.44
  Bottom 0.127: J2.54 27.71,10.05 27.71,7.61 31.68,3.63 33.74,3.63 34.87,2.5 v34.87,1.44
XDEBUG_RX  (via drill 0.3 pad 0.6)
  Top 0.127: U$1.PAL22 25.09,1.05
  Top 0.508: 25.09,1.05 v25.47,1.42
  Bottom 0.127: v25.47,1.42 25.47,2.25 25.33,2.39 J2.42
XDEBUG_TX  (via drill 0.3 pad 0.6)
  Top 0.127: 26.34,16.53 v26.35,16.52 v26.35,16.51 27.57,15.29 27.57,4.68 U$1.PAK22
  Bottom 0.127: v26.35,16.51 25.33,15.49 J2.41
XGPA3  (via drill 0.3 pad 0.6)
  Top 0.127: U$1.PAL42
  Top 0.508: U$1.PAL42 v47.29,1.45
  Bottom 0.127: J2.70 30.94,7.45 32.42,5.97 39.17,5.97 39.46,5.68 | 39.41,5.73 39.46,5.68 | 39.46,5.68 40.92,4.21 41.8,4.21 43.29,2.73 46.01,2.73 v47.29,1.45
XGPA4  (via drill 0.3 pad 0.6)
  Top 0.127: U$1.PB39 44.28,33.71 42.72,32.15 42.72,26.42 36.89,20.59 v27.36,20.59
  Bottom 0.127: v27.36,20.59 27.33,20.62 27.33,21.71 27.4,21.78 27.4,22.18 27.33,22.25 J1.52
XGPA5  (via drill 0.3 pad 0.6)
  Top 0.127: v43.51,31.37 42.97,30.83 42.97,26.32 36.71,20.05 v28.02,20.05
  Top 0.508: v45.02,33.39 45.41,33.75 U$1.PB40
  Bottom 0.127: J1.54 27.73,21.17 28.02,20.88 v28.02,20.05 | v43.51,31.37 44.03,31.37 45.02,32.36 v45.02,33.39
XGPA6  (via drill 0.3 pad 0.6)
  Top 0.127: U$1.PAK42 47.03,2.73 46.19,2.73 45.99,2.93 45.99,3.8 44.17,5.62 44.17,10.33 39.03,15.47 35.81,15.47 34.94,16.34 v34.97,16.51
  Bottom 0.127: v34.97,16.51 32.51,14.03 29.96,14.03 29.72,13.79 29.73,13.78 J2.63
XGPA15  (via drill 0.3 pad 0.6)
  Top 0.127: U$1.PA41 45.98,34.39 41.7,34.39 41.44,34.13 41.44,30.27 38.03,26.86 29.08,26.86 v29.02,26.92
  Bottom 0.127: J1.55 28.13,26.31 28.74,26.92 v29.02,26.92
XGPA16  (via drill 0.3 pad 0.6)
  Top 0.127: v43.84,30.65 43.79,30.6 43.79,30.53 43.23,29.97 43.23,26.21 36.74,19.72 28.93,19.72 v28.63,19.42 | 46.56,33.75 U$1.PB41
  Top 0.508: v46.12,33.38 46.56,33.75
  Bottom 0.127: J1.56 28.13,21.54 28.87,20.8 28.87,19.75 28.63,19.51 v28.63,19.42 | v43.84,30.65 45.7,32.51 45.7,32.96 v46.12,33.38
XGPA17  (via drill 0.3 pad 0.6)
  Top 0.508: U$1.PAL41 46.54,1.11 v46.17,1.46
  Bottom 0.127: J2.68 30.53,7.5 32.31,5.72 39.06,5.72 40.82,3.96 41.7,3.96 43.38,2.28 45.37,2.28 46.03,1.62 v46.17,1.46
XGPA21  (via drill 0.3 pad 0.6)
  Top 0.127: U$1.PAK40 44.85,2.72 44.85,4.56 43.92,5.51 43.92,10.23 38.94,15.2 35.41,15.2 v34.11,16.5
  Bottom 0.127: v34.11,16.5 31.9,14.29 29.51,14.29 29.33,14.11 J2.61
XGPB16  (via drill 0.3 pad 0.6)
  Top 0.127: U$1.PAL37 42.02,1.07
  Top 0.508: 42.02,1.07 v41.64,1.46
  Bottom 0.127: J2.66 30.13,7.54 32.21,5.46 38.96,5.46 41.64,2.78 v41.64,1.46
XGPB22  (via drill 0.3 pad 0.6)
  Top 0.508: U$1.PAL36 v40.5,1.44
  Bottom 0.127: v40.5,1.44 40.31,1.63 40.31,2.84 37.94,5.21 32.1,5.21 29.73,7.58 J2.64
XGPC0  (via drill 0.3 pad 0.6)
  Top 0.127: U$1.PAK34 38.63,2.56 32.35,8.84 v32.35,16.5 v32.36,16.51
  Bottom 0.127: v32.36,16.51 30.64,14.79 29.21,14.79 28.52,14.1 J2.57
XGPC25  (via drill 0.3 pad 0.6)
  Top 0.127: U$1.PAH41 45.79,4.44 44.43,5.78 44.43,10.43 39.14,15.72 36.58,15.72 v35.84,16.49 35.83,16.45
  Bottom 0.127: v35.84,16.49 33.16,13.78 30.27,13.78 30.13,13.64 J2.65
XGPD8  (via drill 0.3 pad 0.6)
  Top 0.127: U$1.PAL33
  Top 0.508: U$1.PAL33 v37.12,1.47
  Bottom 0.127: J2.58 28.53,7.51 31.59,4.45 35.17,4.45 37.12,2.5 v37.12,1.47
XGPE30  (via drill 0.35)
  Top 0.127: U$1.PAL34 38.63,1.09
  Top 0.508: 38.63,1.09 v38.26,1.47
  Bottom 0.127: J2.60 28.93,7.66 31.89,4.7 36.07,4.7 38.27,2.5 v38.27,1.47 | v38.26,1.47 v38.27,1.47 | v38.27,1.47 38.29,1.45
XGPE31  (via drill 0.3 pad 0.6)
  Top 0.127: U$1.PAH42 47.11,5 45.92,5 44.68,6.24 44.68,10.54 38.74,16.48 v36.72,16.5
  Bottom 0.127: v36.72,16.5 33.76,13.52 30.73,13.52 30.53,13.32 J2.67
XGPIO0  (via drill 0.3 pad 0.6)
  Top 0.127: U$1.PAG2 2.49,5.55
  Top 0.508: 2.49,5.55 v3,5.55
  Bottom 0.127: J2.12 19.33,9.51 18.02,8.2 12.38,8.2 12.37,8.21 7.68,8.21 5.02,5.55 v3,5.55
XGPIO1  (via drill 0.3 pad 0.6)
  Top 0.127: v11.79,16.51 11.78,16.39 11.09,15.7 8.31,15.7 4.2,11.59 4.2,5.68 3.53,5.01 1.91,5.01 U$1.PAH1
  Bottom 0.127: J2.13 19.73,13.43 19.72,13.43 18.21,14.94 13.36,14.94 v11.79,16.51
XGPIO2  (via drill 0.3 pad 0.6)
  Top 0.127: U$1.PAH2 2.5,4.47
  Top 0.508: 2.5,4.47 v3.01,4.47
  Bottom 0.127: J2.14 19.73,9.51 18.17,7.95 12.27,7.95 12.27,7.96 7.78,7.96 4.3,4.47 v3.01,4.47
XGPIO3  (via drill 0.3 pad 0.6)
  Top 0.127: 2.92,3.31 v2.99,3.37
  Top 0.508: U$1.PAJ2 2.92,3.31
  Bottom 0.127: J2.16 20.13,9.51 18.32,7.7 12.17,7.7 12.16,7.7 7.89,7.7 3.56,3.37 v2.99,3.37
XGPIO4  (via drill 0.3 pad 0.6)
  Top 0.127: 24.55,16.56 24.52,16.53 v24.52,16.51 25.2,15.83 25.2,5.05 22.81,2.66 U$1.PAK20
  Bottom 0.127: v24.52,16.51 J2.37
XGPIO5  (via drill 0.3 pad 0.6)
  Top 0.127: 24.28,1.39 v24.35,1.42
  Top 0.508: U$1.PAL21 24.28,1.39
  Bottom 0.127: J2.40 24.93,7.3 24.35,6.72 v24.35,1.42
XGPIO6  (via drill 0.3 pad 0.6)
  Top 0.127: 25.45,16.53 v25.45,16.5 25.45,4.63 23.94,3.12 U$1.PAK21
  Bottom 0.127: v25.45,16.5 25.45,16.09 24.92,15.56 J2.39
XGPIO7  (via drill 0.3 pad 0.6)
  Top 0.127: U$1.PAK37 42.02,5.46 43.66,7.1 43.66,10.12 38.84,14.95 35.3,14.95 34.78,14.95 v33.22,16.51
  Bottom 0.127: v33.22,16.51 31.25,14.54 29.32,14.54 28.93,14.15 J2.59
XHDMI_CEC  (via drill 0.25 pad 0.6)
  Top 0.127: U$1.PA29 32.45,34.42 32.45,33.44 32.24,33.23 24.91,33.23 v23.97,32.29
  Bottom 0.127: 23.76,25.52 J1.33 23.73,26.95 23.41,27.27 23.41,31.73 v23.97,32.29
XHDMI_HPD  (via drill 0.25 pad 0.6, 0.3 pad 0.6)
  Top 0.127: U$1.PB29 32.98,33.2 32.76,32.98 25.51,32.98 24.16,31.63 24.05,31.63 v23.99,31.57 v23.99,31.56 | v24.74,28.87 24.74,27.32 24.42,27 24.42,24.85 24.43,24.84 24.43,24.35 23.91,23.83 23.91,23.37 23.71,23.17 23.71,22.28 v24,21.99
  Bottom 0.127: v23.99,31.56 23.68,31.25 23.68,29.93 v24.74,28.87 | J1.34 23.73,22.26 v24,21.99
XHDMI_I2C_SCL  (via drill 0.3 pad 0.6)
  Top 0.127: U$1.PAK11 12.64,5.26 16.62,9.24 16.62,13.79 17.8,14.97 21.72,14.97 21.73,14.97 v23.11,16.51
  Bottom 0.127: v23.11,16.51 23.06,14.02 23.73,13.35 J2.33
XHDMI_I2C_SDA  (via drill 0.3 pad 0.6)
  Top 0.127: U$1.PAL11 12.66,1.05
  Top 0.508: 12.66,1.05 v13.03,1.43
  Bottom 0.127: J2.34 23.73,9.48 19.66,5.41 15.3,5.41 13.03,3.14 v13.03,1.43
XHDMI_TX0_N  (via drill 0.3 pad 0.6)
  Top 0.127: U$1.PA32 35.79,34.5 35.76,34.47 35.76,33.5 36.11,33.15 36.11,32.77 35.9,32.56 arc-90 35.59,32.56 arc90 35.27,32.56 35.25,32.53 arc90 35.25,32.22 arc-90 35.25,31.91 35.22,31.88 arc-90 34.91,31.88 arc90 34.59,31.88 34.57,31.86 arc90 34.57,31.54 arc-90 34.57,31.23 34.42,31.08 28.17,31.08 26.67,29.58 26.67,28.4 26.37,28.1 v26.03,28.1
  Bottom 0.127: v26.03,28.1 25.83,28.1 24.93,27.2 J1.39
XHDMI_TX0_P  (via drill 0.3 pad 0.6)
  Top 0.127: v25.21,24.66 25.24,24.69 25.24,25.19 25.04,25.39 25.04,26.41 26.93,28.3 26.93,29.48 28.27,30.82 34.52,30.82 36.36,32.66 36.36,32.88 U$1.PB32
  Bottom 0.127: 24.99,22.84 J1.40 24.93,23.45 25.04,23.56 25.04,23.96 24.93,24.07 24.93,24.38 v25.21,24.66
XHDMI_TX1_N  (via drill 0.3 pad 0.6)
  Top 0.127: U$1.PA31 34.66,34.5 34.66,33.07 33.47,31.88 27.93,31.88 27.27,31.21 arc-90 26.95,31.21 26.86,31.3 arc90 26.55,31.3 26.53,31.28 arc90 26.53,30.97 26.62,30.88 arc-90 26.62,30.57 26.6,30.55 arc-90 26.29,30.55 26.2,30.64 arc90 25.89,30.64 25.87,30.62 arc90 25.87,30.3 25.95,30.22 arc-90 25.95,29.9 25.61,29.56 v25.61,29.2
  Bottom 0.127: v25.61,29.2 25.61,28.77 24.53,27.69 J1.37
XHDMI_TX1_P  (via drill 0.3 pad 0.6)
  Top 0.127: U$1.PB31 34.92,33.37 34.92,32.97 33.58,31.63 28.04,31.63 27.45,31.04 26.13,29.72 26.1,29.69 26.1,28.93 25.15,27.98 25.15,26.95 24.7,26.5 24.7,23.89 v24.55,23.76
  Bottom 0.127: 24.54,22.79 J1.38 24.53,23.74 v24.55,23.76
XHDMI_TX2_N  (via drill 0.3 pad 0.6)
  Top 0.127: U$1.PA30 33.5,34.45 33.5,33.03 32.96,32.49 26.78,32.49 26.71,32.42 arc-90 26.4,32.42 arc90 26.08,32.42 26.05,32.39 arc90 26.05,32.08 arc-90 26.05,31.76 26.02,31.73 arc-90 25.71,31.73 arc90 25.39,31.73 25.37,31.7 arc90 25.37,31.39 arc-90 25.37,31.08 25.34,31.05 arc-90 25.02,31.05 arc90 24.71,31.05 24.68,31.02 arc90 24.68,30.7 arc-90 24.68,30.39 24.65,30.36 arc-90 24.34,30.36 arc90 24.02,30.36 23.99,30.33 arc90 23.99,30.02 arc-90 23.99,29.7 23.91,29.62 23.91,27.73 v23.9,27.71
  Bottom 0.127: J1.35 24.14,25.5 24.14,26.9 23.9,27.14 v23.9,27.71
XHDMI_TX2_P  (via drill 0.3 pad 0.6)
  Top 0.127: 24.07,24.77 v23.94,24.64 24.03,24.73 24.03,25.15 24.14,25.26 24.14,27.23 | 24.14,27.26 24.14,27.23 | 24.14,27.23 24.39,27.48 24.39,27.91 24.17,28.14 24.17,29.52 26.89,32.24 33.29,32.24 34.11,33.06 U$1.PB30
  Bottom 0.127: 24.16,22.8 J1.36 24.13,23.49 24.06,23.56 24.06,23.96 24.13,24.03 24.13,24.45 v23.94,24.64
XHDMI_TXC_N  (via drill 0.3 pad 0.6)
  Top 0.127: U$1.PA33 36.93,34.51 36.93,31.74 35.22,30.03 32.91,30.03 arc-90 32.69,30.25 32.69,30.33 arc90 32.47,30.55 32.39,30.55 arc90 32.17,30.33 32.17,30.25 arc-90 31.95,30.03 31.87,30.03 arc-90 31.65,30.25 31.65,30.33 arc90 31.43,30.55 31.35,30.55 arc90 31.13,30.33 31.13,30.25 arc-90 30.91,30.03 28.56,30.03 27.82,29.29 v27.48,29.29
  Bottom 0.127: J1.41 25.33,26.1 27.48,28.25 v27.48,29.29
XHDMI_TXC_P  (via drill 0.3 pad 0.6)
  Top 0.127: U$1.PB33 37.5,31.95 35.32,29.77 28.66,29.77 27.45,28.56 27.45,27.8 25.83,26.18 25.83,24.17 v25.57,23.91
  Bottom 0.127: J1.42 25.33,23.67 v25.57,23.91
XI2C_SCL0  (via drill 0.3 pad 0.6)
  Top 0.127: U$1.PAK10 11.51,4.49 16.36,9.34 16.36,13.89 17.69,15.22 20.93,15.22 v22.23,16.52
  Bottom 0.127: v22.23,16.52 22.23,14.49 23.33,13.39 J2.31
XI2C_SCL1  (via drill 0.3 pad 0.6)
  Top 0.127: U$1.PAK9 10.38,3.72 16.11,9.45 16.11,14 17.58,15.48 20.26,15.48 v21.3,16.52
  Bottom 0.127: v21.3,16.52 21.3,14.96 22.93,13.33 J2.29
XI2C_SCL2  (via drill 0.3 pad 0.6)
  Top 0.127: U$1.PAK8 9.76,2.69 9.76,3.46 15.85,9.55 15.85,14.11 17.48,15.73 19.61,15.73 v20.4,16.52
  Bottom 0.127: v20.4,16.52 20.4,15.46 22.51,13.35 22.51,12.8 J2.27
XI2C_SDA0  (via drill 0.3 pad 0.6)
  Top 0.508: U$1.PAL10 v11.91,1.42
  Bottom 0.127: J2.32 23.33,9.48 19.51,5.66 14.86,5.66 11.91,2.71 v11.91,1.42
XI2C_SDA1  (via drill 0.3 pad 0.6)
  Top 0.127: U$1.PAL9 10.4,1.05
  Top 0.508: 10.4,1.05 v10.81,1.43
  Bottom 0.127: J2.30 22.93,9.48 19.37,5.92 14.28,5.92 10.81,2.45 v10.81,1.43
XI2C_SDA2  (via drill 0.3 pad 0.6)
  Top 0.127: U$1.PAL8 9.28,1.05
  Top 0.508: 9.28,1.05 v9.65,1.42
  Bottom 0.127: J2.28 22.53,9.76 18.95,6.17 13.18,6.17 9.65,2.64 v9.65,1.42
XI2S0_BCLK  (via drill 0.3 pad 0.6)
  Top 0.127: v14.41,16.49 12.85,14.94 8.62,14.94 4.96,11.27 4.96,4.28 3.21,2.53 2.82,2.53 U$1.PAK2
  Bottom 0.127: v14.41,16.49 15.21,15.7 18.51,15.7 18.62,15.7 18.71,15.7 20.93,13.48 J2.19
XI2S0_DIN  (via drill 0.3 pad 0.6)
  Top 0.127: 1.67,1.38 v1.73,1.41
  Top 0.508: U$1.PAL1 1.67,1.38
  Bottom 0.127: J2.18 20.53,9.55 18.42,7.44 12.06,7.44 12.06,7.45 7.99,7.45 3.39,2.84 3.16,2.84 v1.73,1.41
XI2S0_DOUT  (via drill 0.3 pad 0.6)
  Top 0.127: v13.52,16.49 12.22,15.19 8.52,15.19 4.71,11.38 4.71,4.39 3.1,2.78 1.94,2.78 U$1.PAK1
  Bottom 0.127: v13.52,16.49 14.57,15.44 18.52,15.44 20.54,13.48 20.54,12.82 J2.17
XI2S0_LRCLK  (via drill 0.3 pad 0.6)
  Top 0.127: v12.65,16.5 11.61,15.45 8.41,15.45 4.45,11.48 4.45,4.89 3.44,3.88 1.91,3.88 U$1.PAJ1
  Bottom 0.127: J2.15 20.13,13.46 18.4,15.19 13.96,15.19 v12.65,16.5
XI2S0_MCLK  (via drill 0.3 pad 0.6)
  Top 0.508: U$1.PAL2 v2.86,1.42
  Bottom 0.127: J2.20 20.93,9.59 18.53,7.19 11.96,7.19 11.95,7.19 8.1,7.19 3.91,3 3.91,2.47 v2.86,1.42
XMIPICSI_D0_N  (via drill 0.3 pad 0.6)
  Top 0.127: U$1.PA11 13.21,34.51 13.21,30.64 14.02,29.83 arc90 14.33,29.83 14.4,29.9 arc-90 14.72,29.9 14.8,29.82 arc-90 14.8,29.51 14.73,29.43 arc90 14.73,29.12 14.81,29.04 arc90 15.12,29.04 15.2,29.11 arc-90 15.51,29.11 15.59,29.03 arc-90 15.59,28.72 15.52,28.64 arc90 15.52,28.33 17.04,26.81 v17.48,26.81
  Bottom 0.127: J1.11 19.33,26.05 18.56,26.81 v17.48,26.81
XMIPICSI_D0_P  (via drill 0.3 pad 0.6)
  Top 0.127: U$1.PB11 12.95,33.38 12.95,30.54 17.24,26.25 18.53,26.25 18.87,25.91 v18.87,23.93 18.83,23.97
  Bottom 0.127: J1.12 19.33,23.2 18.87,23.66 v18.87,23.93
XMIPICSI_D1_N  (via drill 0.3 pad 0.6)
  Top 0.127: U$1.PA12 14.32,34.58 14.32,32.04 15.06,31.3 arc90 15.38,31.3 15.39,31.31 arc-90 15.7,31.31 15.73,31.27 arc-90 15.73,30.96 15.72,30.95 arc90 15.72,30.64 15.75,30.61 arc90 16.07,30.61 16.08,30.61 arc-90 16.39,30.61 16.43,30.59 arc-90 16.43,30.27 16.41,30.26 arc90 16.41,29.95 16.45,29.91 arc90 16.76,29.91 16.77,29.93 arc-90 17.08,29.93 17.11,29.89 arc-90 17.11,29.58 17.11,29.57 arc90 17.11,29.25 18.4,27.96 18.68,27.96 18.98,27.65 v19.02,27.65
  Bottom 0.127: J1.13 19.73,26.05 18.98,26.8 18.98,27.61 v19.02,27.65
XMIPICSI_D1_P  (via drill 0.3 pad 0.6)
  Top 0.127: v19.6,23.72 19.34,24.1 19.34,24.82 19.67,25.15 19.67,26.25 13.77,32.23 U$1.PB12
  Bottom 0.127: 19.72,22.79 J1.14 19.73,23.24 19.64,23.33 19.64,23.68 v19.6,23.72
XMIPICSI_D2_N  (via drill 0.3 pad 0.6)
  Top 0.127: U$1.PA13 15.51,34.47 15.51,32.54 16.16,31.89 arc90 16.48,31.89 16.49,31.91 arc-90 16.81,31.91 16.83,31.88 arc-90 16.83,31.57 16.82,31.55 arc90 16.82,31.23 16.84,31.21 arc90 17.15,31.21 17.17,31.23 arc-90 17.49,31.23 17.51,31.2 arc-90 17.51,30.89 17.49,30.87 arc90 17.49,30.56 17.52,30.53 arc90 17.83,30.53 17.85,30.55 arc-90 18.16,30.55 18.19,30.53 arc-90 18.19,30.21 18.17,30.19 arc90 18.17,29.88 18.72,29.33 v18.86,29.33
  Bottom 0.127: J1.15 20.13,26.41 19.68,26.86 19.68,27.69 18.85,28.52 v18.85,29.32 v18.86,29.33
XMIPICSI_D2_P  (via drill 0.3 pad 0.6)
  Top 0.127: v19.84,24.41 19.85,24.8 20.12,25.07 20.12,26.26 19.51,26.87 19.51,27.88 18.37,29.02 18.37,29.32 14.9,32.79 U$1.PB13
  Bottom 0.127: J1.16 20.12,22.79 20.12,24.1 19.83,24.32 v19.84,24.41
XMIPICSI_D3_N  (via drill 0.3 pad 0.6)
  Top 0.127: U$1.PA14 16.64,34.47 16.64,33.01 arc90 16.95,33.01 17.04,33.1 arc-90 17.36,33.1 17.43,33.03 arc-90 17.43,32.71 17.34,32.62 arc90 17.34,32.31 17.41,32.23 arc90 17.73,32.23 17.82,32.32 arc-90 18.13,32.32 18.21,32.25 arc-90 18.21,31.93 18.12,31.84 arc90 18.12,31.53 18.19,31.46 arc90 18.51,31.46 18.6,31.55 arc-90 18.91,31.55 18.99,31.47 arc-90 18.99,31.16 18.9,31.07 arc90 18.9,30.75 18.97,30.68 arc90 19.29,30.68 19.38,30.77 arc-90 19.69,30.77 19.76,30.69 arc-90 19.76,30.38 19.68,30.29 arc90 19.68,29.98 19.83,29.82 19.83,29.19 19.71,29.07 v19.71,28.74
  Bottom 0.127: J1.17 20.52,25.5 20.52,26.67 20.53,26.68 20.08,27.13 20.08,27.48 20.49,27.89 20.49,28.14 20.49,28.15 20.49,28.25 20.35,28.39 20.19,28.39 20.08,28.28 19.92,28.28 19.71,28.49 v19.71,28.74
XMIPICSI_D3_P  (via drill 0.3 pad 0.6)
  Top 0.127: U$1.PB14 16.38,33.34 16.38,32.91 19.57,29.72 19.57,29.3 19.22,28.94 19.22,28.54 19.5,28.25 19.83,28.25 19.97,28.11 19.97,26.9 20.53,26.35 20.53,25.02 20.35,24.84 20.35,24.11 20.19,23.95 20.19,22.18 20.32,22.05 v20.43,21.98
  Bottom 0.127: v20.43,21.98 20.53,22.04 J1.18
XMIPICSI_DCLK_N  (via drill 0.3 pad 0.6)
  Top 0.127: 12.03,33.92 12.03,33.61 11.76,33.34 11.76,29.84 12.5,29.1 arc90 12.81,29.1 12.86,29.14 arc-90 13.17,29.14 13.17,29.14 arc-90 13.17,28.82 13.13,28.78 arc90 13.13,28.47 13.14,28.46 arc90 13.45,28.46 13.49,28.51 arc-90 13.81,28.51 13.81,28.5 arc-90 13.81,28.19 13.77,28.15 arc90 13.77,27.83 13.77,27.83 arc90 14.09,27.83 14.13,27.87 arc-90 14.44,27.87 14.45,27.87 arc-90 14.45,27.55 14.4,27.51 arc90 14.4,27.2 14.41,27.19 arc90 14.72,27.19 14.76,27.23 arc-90 15.08,27.23 15.08,27.23 arc-90 15.08,26.92 15.04,26.87 arc90 15.04,26.56 15.29,26.31 16.03,26.31 v16.05,26.33 | 12.03,33.92 12.04,33.94 | 12.03,33.92 12.03,34.43 U$1.PA10
  Bottom 0.127: J1.9 18.93,25.9 18.51,26.32 v16.06,26.32 v16.05,26.33
XMIPICSI_DCLK_P  (via drill 0.3 pad 0.6)
  Top 0.127: U$1.PB10 11.51,29.73 15.11,26.13 15.11,23.33 16.49,21.95 v18.91,21.95
  Bottom 0.127: 18.92,22.81 18.94,22.79 J1.10 18.93,21.97 v18.91,21.95
XMIPIDSI_D0_N  (via drill 0.3 pad 0.6)
  Top 0.127: U$1.PA17 18.87,34.53 | 18.87,34.53 | v20.98,28.35 20.98,28.7 20.83,28.85 20.83,31.14 18.87,33.1 18.87,34.53
  Bottom 0.127: J1.23 21.73,26.1 22.01,26.38 22.42,26.38 22.54,26.5 22.54,27.38 22.31,27.61 21.24,27.61 20.98,27.87 v20.98,28.35
XMIPIDSI_D0_P  (via drill 0.3 pad 0.6)
  Top 0.127: U$1.PB17 19.42,32.91 21.09,31.24 21.09,28.95 21.48,28.56 21.48,26.62 21.03,26.17 21.03,24.8 20.96,24.73 20.96,24.2 21.44,23.72 v21.42,23.69
  Bottom 0.127: J1.24 21.73,23.43 v21.42,23.69
XMIPIDSI_D1_N  (via drill 0.3 pad 0.6)
  Top 0.127: U$1.PA18 20.01,34.54 20.01,32.88 21.39,31.5 21.39,29.01 21.73,28.67 21.73,24.85 21.73,24.78 v21.45,24.5
  Bottom 0.127: J1.25 22.13,25 21.63,24.5 v21.45,24.5
XMIPIDSI_D1_P  (via drill 0.3 pad 0.6)
  Top 0.127: U$1.PB18 20.27,33.41 20.27,32.98 21.65,31.6 21.65,29.11 21.98,28.77 21.98,24.75 21.98,24.74 21.98,23.88 22.2,23.66 v22.2,22
  Bottom 0.127: J1.26 22.13,22.07 v22.2,22
XMIPIDSI_D2_N  (via drill 0.3 pad 0.6)
  Top 0.127: U$1.PA19 22.26,34.5 22.26,33.45 22.27,33.43 22.26,33.35 22.26,32.82 arc90 22.48,32.6 22.55,32.6 arc-90 22.77,32.38 22.77,32.35 arc-90 22.55,32.13 22.48,32.13 arc90 22.26,31.9 22.26,31.88 arc90 22.48,31.65 22.55,31.65 arc-90 22.77,31.43 22.77,31.4 arc-90 22.55,31.18 22.48,31.18 arc90 22.26,30.96 22.26,30.75 v22.56,30.45
  Bottom 0.127: J1.27 22.53,25.92 22.79,26.18 22.79,27.48 22.56,27.72 v22.56,30.45
XMIPIDSI_D2_P  (via drill 0.3 pad 0.6)
  Top 0.127: U$1.PB19 22,33.37 22,30.18 22.43,29.75 22.43,26.84 22.41,25.25 22.4,24.7 22.4,24.25 v22.48,24.17
  Bottom 0.127: J1.28 22.53,24.12 v22.48,24.17
XMIPIDSI_D3_N  (via drill 0.3 pad 0.6)
  Top 0.127: U$1.PA20 23.41,34.48 23.41,23.58 v23.42,23.57
  Bottom 0.127: 22.91,25.46 J1.29 | J1.29 | J1.29 22.93,25.17 23.14,24.96 23.25,24.96 23.39,24.82 23.39,23.6 v23.42,23.57
XMIPIDSI_D3_P  (via drill 0.3 pad 0.6)
  Top 0.127: U$1.PB20 23.15,33.35 23.15,24 22.93,23.77 22.93,23.37 23.15,23.14 23.15,22.18 v22.96,21.99
  Bottom 0.127: v22.96,21.99 22.96,22.74 J1.30
XMIPIDSI_DCLK_N  (via drill 0.3 pad 0.6)
  Top 0.127: U$1.PA16 17.75,34.54 17.75,33.14 20.22,30.67 20.22,27.68 v20.66,27.25
  Bottom 0.127: v20.66,27.25 21.93,27.25 22.15,27.03 22.16,27.03 22.16,26.84 22.04,26.72 21.1,26.72 20.87,26.49 20.87,26.26 20.98,26.15 21.24,26.15 21.33,26.06 J1.21
XMIPIDSI_DCLK_P  (via drill 0.3 pad 0.6)
  Top 0.127: U$1.PB16 18.29,32.96 20.49,30.76 20.49,28.15 21.17,27.46 21.17,26.78 20.78,26.39 20.78,24.91 20.64,24.77 20.64,23.6 v20.69,23.55
  Bottom 0.127: v20.69,23.55 20.95,23.3 21.12,23.3 21.33,23.09 J1.22
XNRESET  (via drill 0.3 pad 0.6)
  Top 0.127: U$1.PAG1 1.74,5.57 2.26,6.08 3.54,6.08 3.94,6.49 3.94,11.69 8.22,15.97 10.37,15.97 10.91,16.51 v10.96,16.51
  Bottom 0.127: J2.11 19.33,13.46 18.11,14.68 12.79,14.68 v10.96,16.51
XOTG_D_N  (via drill 0.3 pad 0.6)
  Top 0.127: U$1.PA35 39.19,34.51 39.19,32.72 35.19,28.72 31.95,28.72 arc-90 31.73,28.94 31.73,29.04 arc90 31.51,29.26 31.42,29.26 arc90 31.2,29.04 31.2,28.94 arc-90 30.98,28.72 30.89,28.72 arc-90 30.67,28.94 30.67,29.04 arc90 30.45,29.26 30.37,29.26 arc90 30.15,29.04 30.15,28.94 arc-90 29.92,28.72 28.7,28.72 | 28.7,28.72 28.65,28.72 | 28.7,28.72 28.37,28.72 v28.32,28.67
  Bottom 0.127: J1.45 26.13,26.32 28.25,28.44 v28.32,28.67
XOTG_D_P  (via drill 0.3 pad 0.6)
  Top 0.127: U$1.PB35 39.45,33.38 39.45,32.62 35.3,28.47 28.81,28.47 28.52,28.18 28.38,28.18 26.34,26.14 v26.34,24.7
  Bottom 0.127: 26.15,22.8 J1.46 26.13,23.36 26.31,23.55 26.31,24.67 v26.34,24.7
XOTG_ID  (via drill 0.3 pad 0.6)
  Top 0.127: v26.91,21.98 26.91,21.43 27.23,21.11 36.93,21.11 42.02,26.2 42.02,27.71 42.02,27.82 U$1.PB37
  Bottom 0.127: J1.50 26.93,22 v26.91,21.98
XPGC27  (via drill 0.3 pad 0.6)
  Top 0.508: U$1.PAL35 v39.38,1.46
  Bottom 0.127: J2.62 29.33,7.62 32,4.95 37.08,4.95 39.38,2.65 v39.38,1.46
XPWERKEY  (via drill 0.3 pad 0.6)
  Top 0.127: U$1.PAF1 1.93,7.29 3.44,7.29 3.62,7.47 3.62,11.73 8.37,16.48 10.06,16.48 v10.08,16.5
  Bottom 0.127: v10.08,16.5 12.16,14.43 17.71,14.43 18.93,13.21 J2.9
XPWM0  (via drill 0.3 pad 0.6)
  Top 0.508: U$1.PAL7 8.14,1.05 v8.51,1.42
  Bottom 0.127: J2.26 22.13,9.71 18.84,6.43 12.04,6.43 8.51,2.9 v8.51,1.42
XPWM1  (via drill 0.3 pad 0.6)
  Top 0.127: U$1.PAK7 15.6,9.66 15.6,14.21 17.91,16.52 v19.54,16.52
  Bottom 0.127: J2.25 22.1,12.81 22.1,13.39 21.98,13.51 21.98,13.52 19.54,15.96 v19.54,16.52
XSD0_CLK  (via drill 0.3 pad 0.6)
  Top 0.127: U$1.PAK29 32.98,7.13 31.59,8.52 31.59,14.69 v29.76,16.52
  Bottom 0.127: v29.76,16.52 28.8,15.56 27.85,15.56 26.93,14.64 J2.49
XSD0_CMD  (via drill 0.3 pad 0.6)
  Top 0.127: U$1.PAK28 31.85,7.9 31.33,8.42 31.33,14.12 v28.91,16.54
  Bottom 0.127: v28.91,16.54 28.18,15.81 27.71,15.81 26.53,14.63 J2.47
XSD0_D0  (via drill 0.3 pad 0.6)
  Top 0.508: U$1.PAL30 34.11,1.08 v33.73,1.46
  Bottom 0.127: J2.52 27.31,10.05 27.31,7.65 31.58,3.38 32.91,3.38 33.73,2.56 v33.73,1.46
XSD0_D1  (via drill 0.3 pad 0.6)
  Top 0.127: v30.63,16.54 31.84,15.33 31.84,8.63 34.11,6.36 U$1.PAK30
  Bottom 0.127: v30.63,16.54 29.39,15.3 27.95,15.3 27.33,14.68 J2.51
XSD0_D2  (via drill 0.3 pad 0.6)
  Top 0.127: U$1.PAL29 32.98,1.1
  Top 0.508: 32.98,1.1 v32.62,1.47
  Bottom 0.127: J2.50 26.93,7.67 31.66,2.94 32.02,2.94 32.62,2.34 v32.62,1.47
XSD0_D3  (via drill 0.3 pad 0.6)
  Top 0.127: U$1.PAL28 31.85,1.07
  Top 0.508: 31.85,1.07 v31.48,1.45
  Bottom 0.127: J2.48 26.51,10.05 26.51,7.73 31.48,2.76 v31.48,1.45
XSPI_CLK  (via drill 0.3 pad 0.6)
  Top 0.127: v16.41,16.5 15.86,15.95 15.07,15.95 13.55,14.43 8.84,14.43 5.47,11.06 5.47,2.92 U$1.PAK4
  Bottom 0.127: J2.23 21.73,13.41 18.92,16.21 18.41,16.21 18.4,16.21 16.7,16.21 v16.41,16.5
XSPI_CS  (via drill 0.3 pad 0.6)
  Top 0.127: 5.09,1.41 v5.13,1.42
  Top 0.508: U$1.PAL4 5.09,1.41
  Bottom 0.127: J2.24 21.73,9.67 18.74,6.68 11.75,6.68 11.74,6.69 8.31,6.69 5.13,3.51 v5.13,1.42 5.13,1.47
XSPI_MISO  (via drill 0.3 pad 0.6)
  Top 0.127: v15.26,16.5 13.44,14.68 12.85,14.68 8.73,14.68 5.21,11.17 5.21,3.79 U$1.PAK3
  Bottom 0.127: v15.26,16.5 15.61,16.5 16.16,15.95 18.51,15.95 18.51,15.96 18.81,15.96 21.18,13.59 21.34,13.43 J2.21
XSPI_MOSI  (via drill 0.3 pad 0.6)
  Top 0.127: v4.02,1.42 v4.01,1.43
  Top 0.508: U$1.PAL3 v4.02,1.42
  Bottom 0.127: J2.22 21.33,9.63 18.63,6.93 11.85,6.93 11.85,6.94 8.2,6.94 4.62,3.36 4.62,1.97 4.08,1.43 v4.01,1.43
XUART_RX0  (via drill 0.3 pad 0.6)
  Top 0.127: U$1.PAL24 27.37,1.05
  Top 0.508: 27.37,1.05 v27.75,1.42
  Bottom 0.127: J2.46 26.14,3.69 27.76,2.07 v27.76,1.43 v27.75,1.42
XUART_RX1  (via drill 0.3 pad 0.6)
  Top 0.127: U$1.PAL23 26.25,1.05
  Top 0.508: 26.25,1.05 v26.62,1.41
  Bottom 0.127: v26.62,1.41 v26.61,1.42 26.61,2.13 25.73,3.01 J2.44
XUART_TX0  (via drill 0.3 pad 0.6)
  Top 0.127: U$1.PAK24 28.08,2.93 v28.08,16.54
  Bottom 0.127: v28.08,16.54 26.13,14.59 J2.45
XUART_TX1  (via drill 0.3 pad 0.6)
  Top 0.127: v27.22,16.53 v27.21,16.53 27.83,15.91 27.83,3.81 U$1.PAK23
  Bottom 0.127: v27.22,16.53 25.74,15.05 J2.43
XUSBH_D_N  (via drill 0.3 pad 0.6)
  Top 0.127: U$1.PA36 40.32,34.51 40.32,31.12 36.87,27.67 31.27,27.67 arc-90 31.05,27.89 31.05,27.97 arc90 30.83,28.19 30.77,28.19 arc90 30.54,27.97 30.54,27.89 arc-90 30.32,27.67 30.26,27.67 arc-90 30.04,27.89 30.04,27.97 arc90 29.82,28.19 29.75,28.19 arc90 29.53,27.97 29.53,27.89 arc-90 29.31,27.67 28.67,27.67 v27.61,26.61
  Bottom 0.127: v27.61,26.61 26.97,26.61 26.53,26.17 J1.47
XUSBH_D_P  (via drill 0.3 pad 0.6)
  Top 0.127: U$1.PB36 40.58,33.38 40.58,31.02 36.97,27.41 28.77,27.41 28.1,26.74 28.1,26.41 27.81,26.12 27.48,26.12 26.97,25.61 v26.97,23.93
  Bottom 0.127: 26.52,22.79 J1.48 26.53,23.28 26.97,23.72 v26.97,23.93
XVDDPWRON  (via drill 0.3 pad 0.6)
  Top 0.508: U$1.PAL19 v22.05,1.42 v22.06,1.42
  Bottom 0.127: J2.38 24.53,7.46 24.04,6.97 24.04,3.37 v22.06,1.42

### Text on the board
bPlace: Jorge Garza / ARTIK530 SOM / REV2 | 1 | 69 | 2 | 70 | VIN | 1 | 69 | 2 | 70 | +3V3